# EasyEDA Pro project LuxcampBadge2025.epro, board PCB
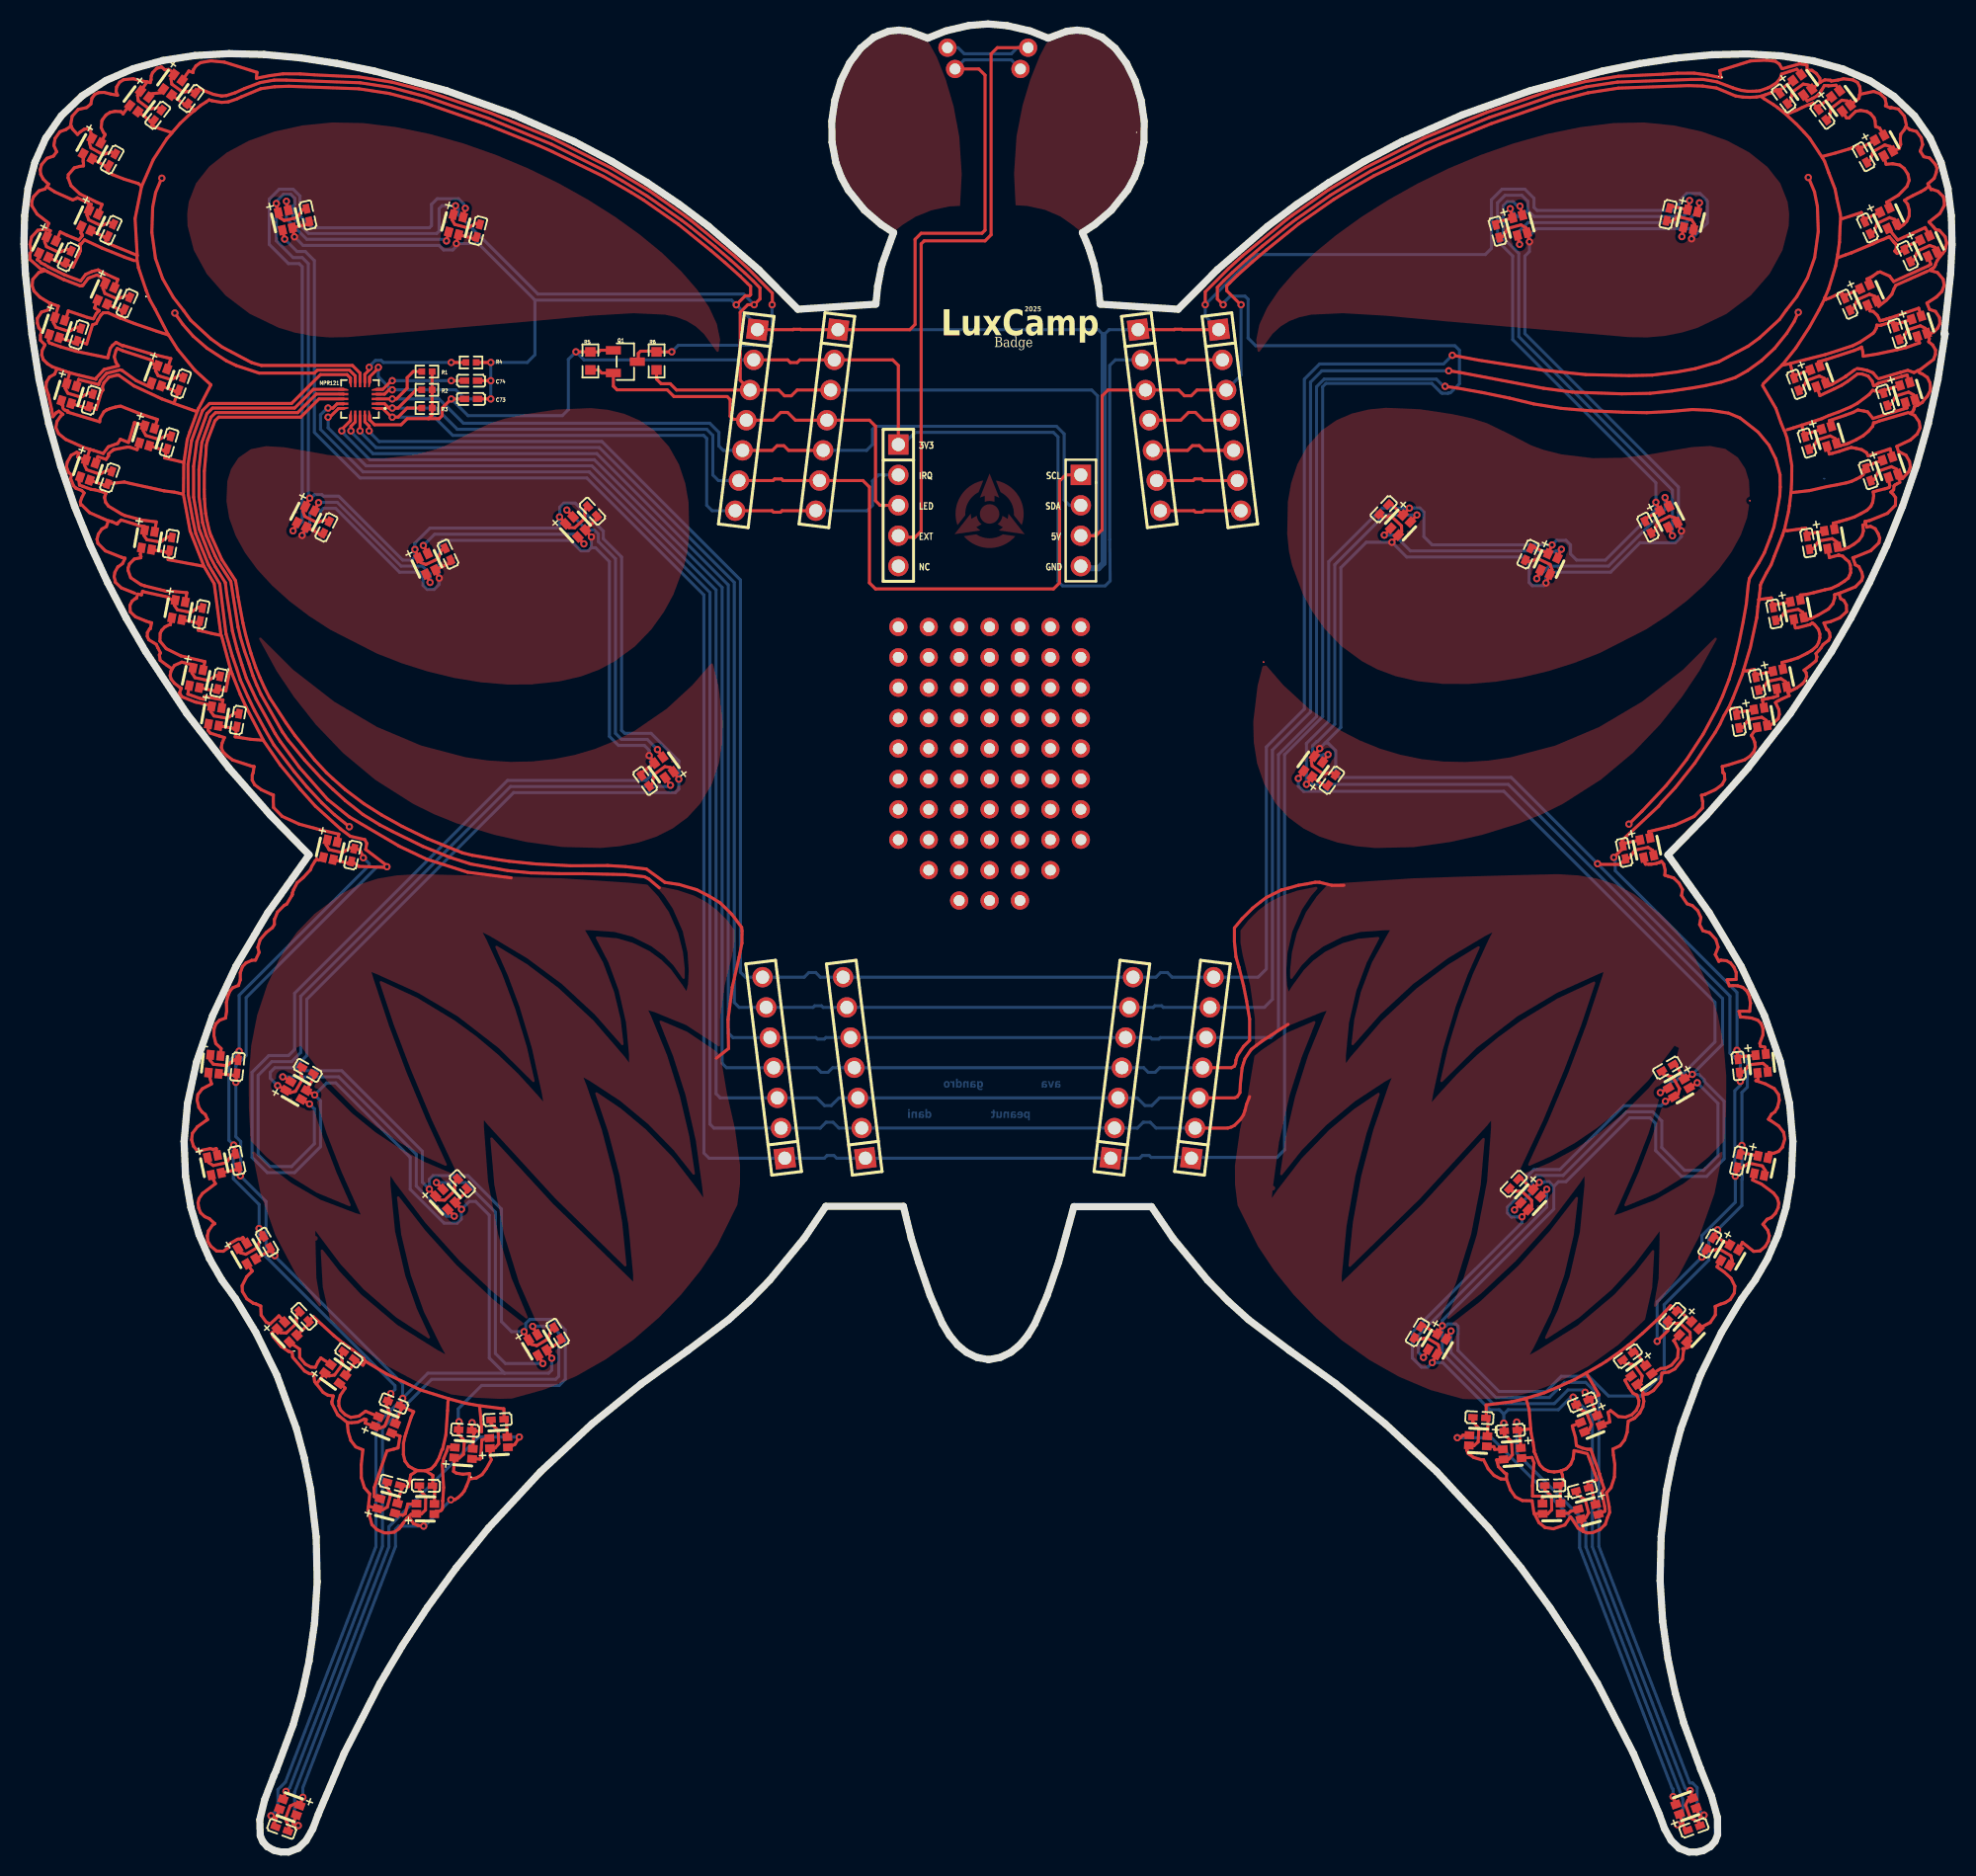
[diagram p9: board, top side]
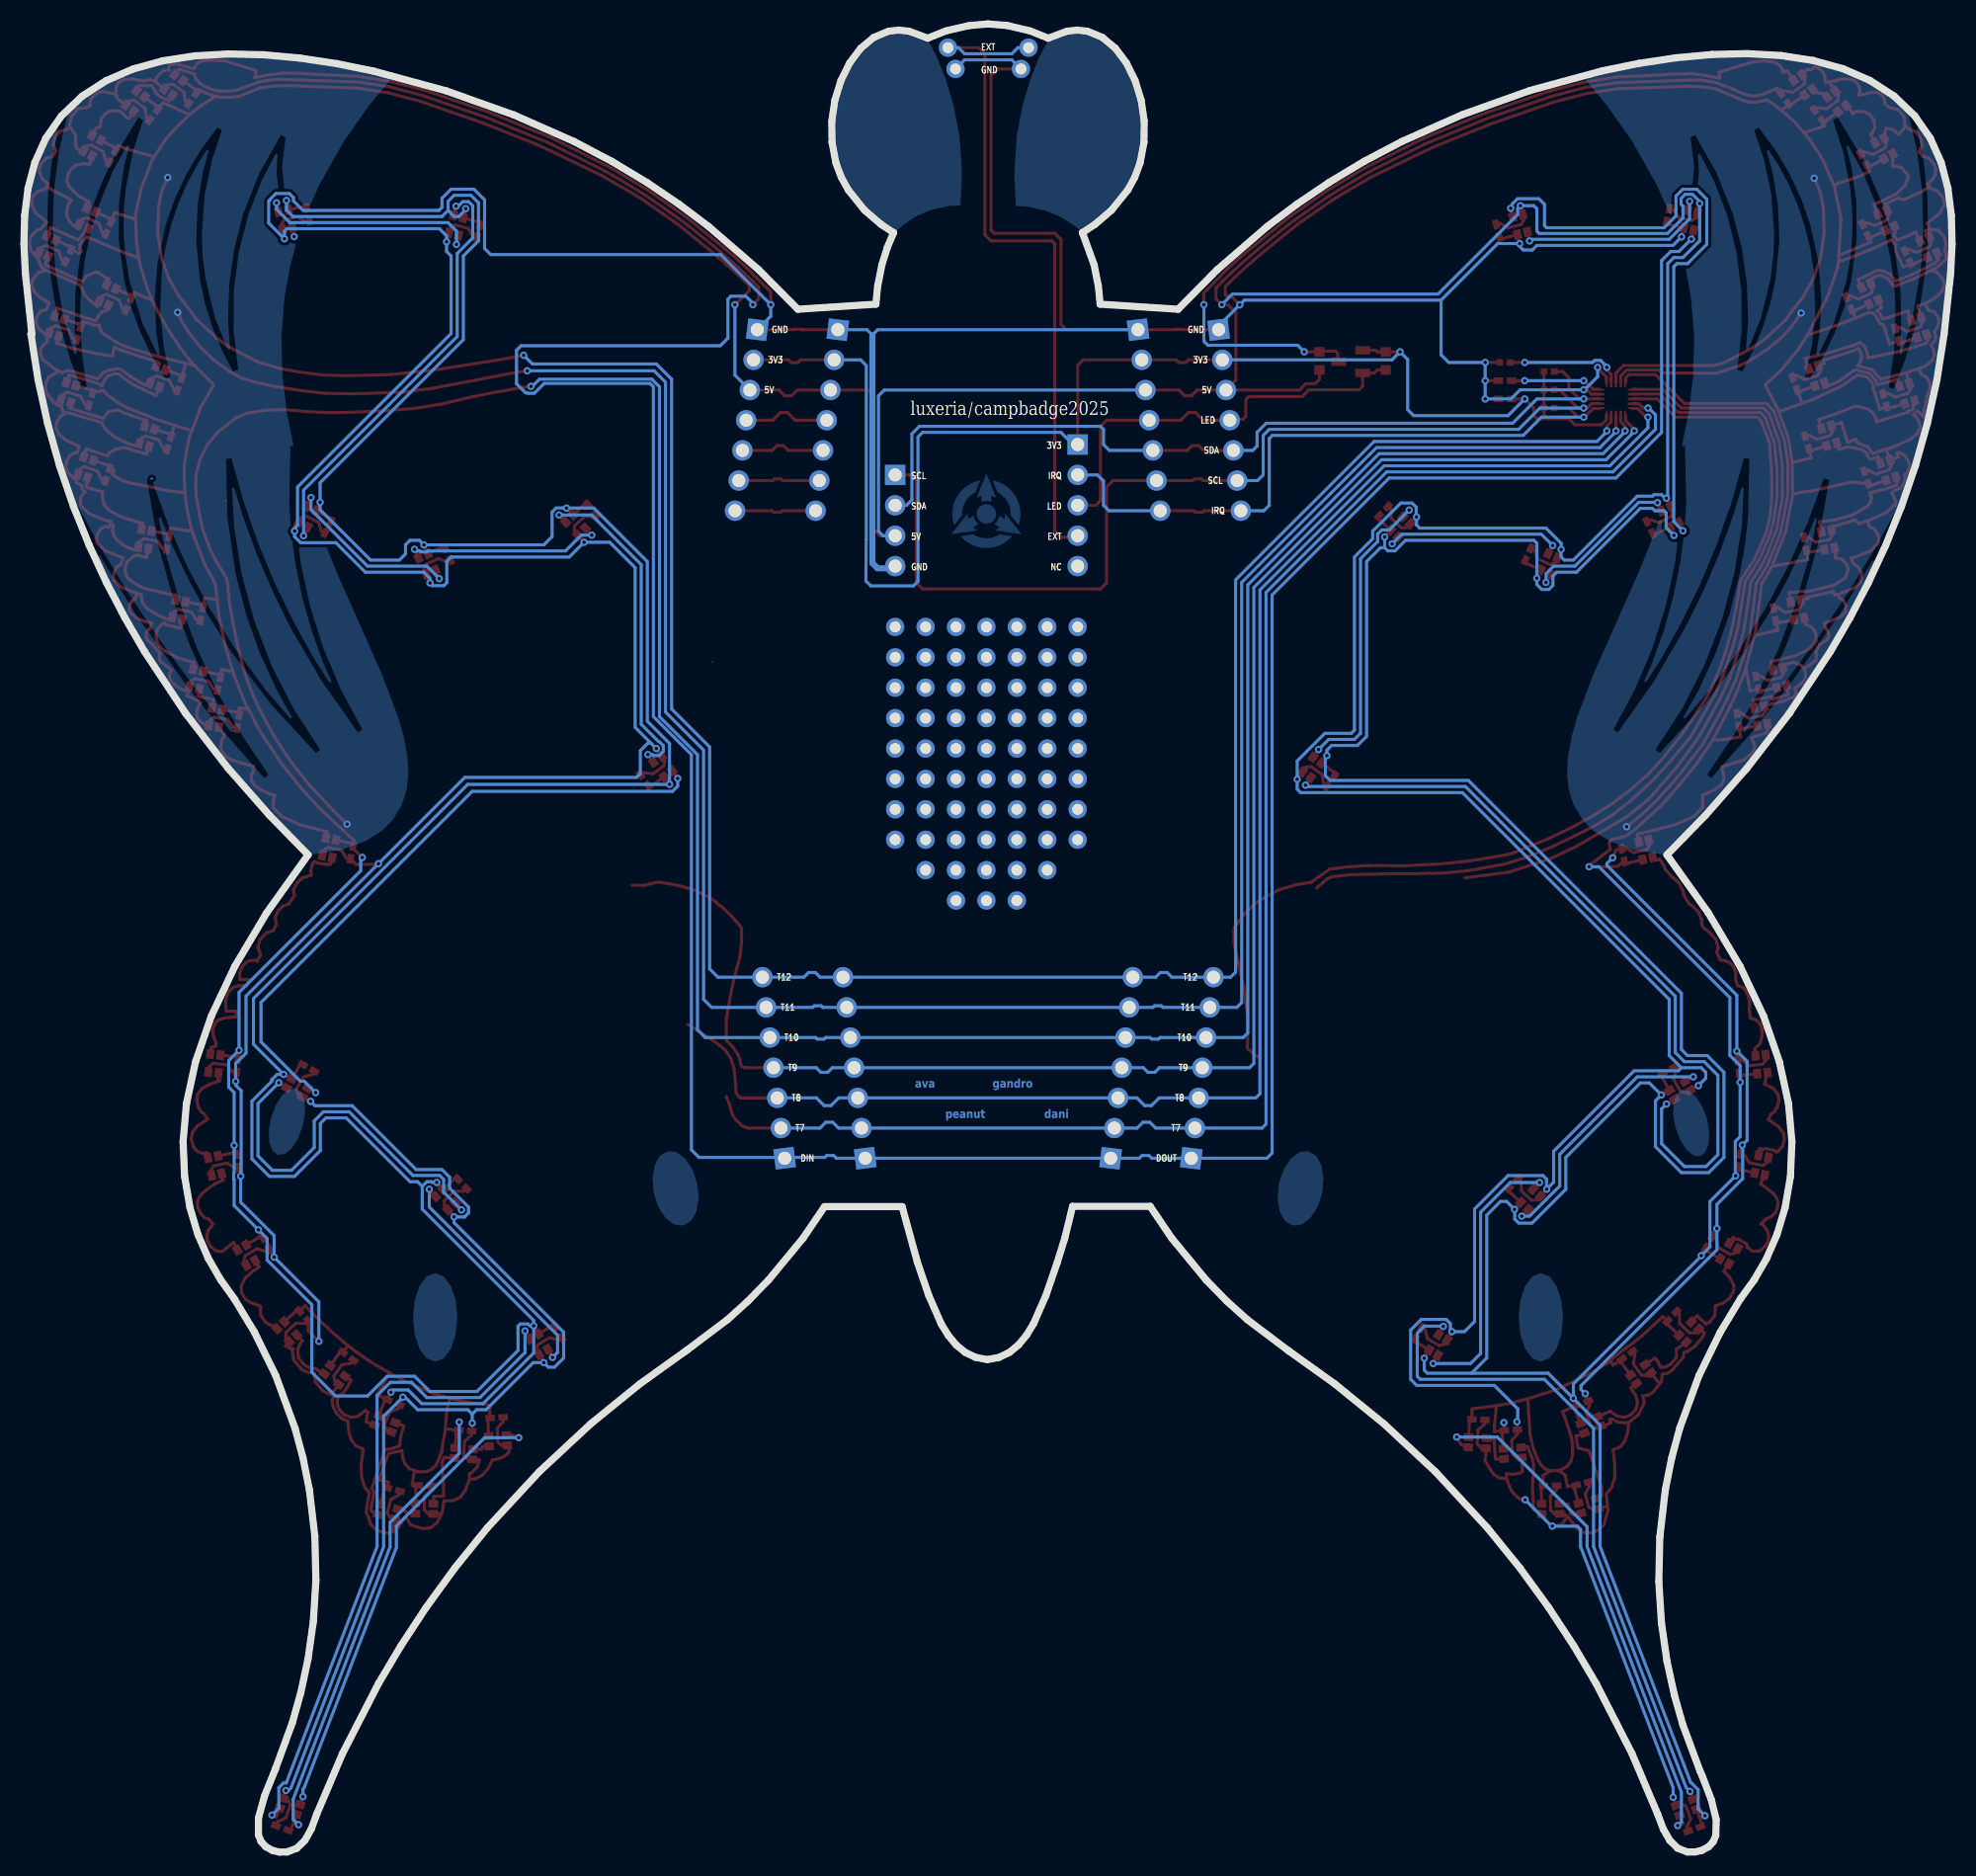
[diagram p10: board, bottom side, seen from below]

Outline 161.02 x 152.75 mm; copper layers: Top Layer, Bottom Layer. Coordinates in mm from the lower left corner of the outline.
Stack: Top Layer 0.035mm / Dielectric1 1.51mm FR4 er 4.5 / Bottom Layer 0.035mm

## Design rules (mm)
template: Custom Config
spacing copperThickness1oz (default): track to track 0.102, other pairs 0.152 to 0.3
spacing copperThickness2oz: track to track 0.203, other pairs 0.152 to 0.3
track width copperThickness1oz (default): min 0.127, default 0.254, max 2.54
track width copperThickness2oz: min 0.203, default 0.254, max 2.54
differential pair differentialPair (default): width min 0.127, default 0.254, max 2.54; gap min 0.152, default 0.152
via viaSize (default): diameter min 0.5, default 0.61, max 10; hole min 0.3, default 0.305, max 6.3
net $3N574 uses aestheticCopperRegion

## Placement (name value [footprint] x y rotation side)
C1  100nF  [C0402]  13.99 146.52 234 top
C2  100nF  [C0402]  11.17 145.11 233 top
C3  100nF  [C0402]  7.37 141.41 241 top
C4  100nF  [C0402]  7.25 135.52 245 top
C5  100nF  [C0402]  3.72 133.28 245 top
C6  100nF  [C0402]  8.62 129.4 246 top
C7  100nF  [C0402]  4.6 126.78 252 top
C8  100nF  [C0402]  13.12 122.68 250 top
C9  100nF  [C0402]  5.6 121.3 253 top
C10  100nF  [C0402]  12.12 117.77 253 top
C11  100nF  [C0402]  7.17 114.84 251 top
C12  100nF  [C0402]  12.27 109.3 260 top
C13  100nF  [C0402]  14.81 103.41 259 top
C14  100nF  [C0402]  16.27 97.7 258 top
C15  100nF  [C0402]  17.87 94.58 260 top
C16  100nF  [C0402]  27.46 83.3 257 top
C17  100nF  [C0402]  17.84 65.61 264 top
C18  100nF  [C0402]  17.8 57.79 282 top
C19  100nF  [C0402]  20.29 50.97 300 top
C20  100nF  [C0402]  23.4 44.76 313 top
C21  100nF  [C0402]  27.14 41.5 324 top
C22  100nF  [C0402]  30.89 37.48 338 top
C23  100nF  [C0402]  30.87 30.78 345 top
C24  100nF  [C0402]  33.57 30.61 359 top
C25  100nF  [C0402]  36.85 35.26 356 top
C26  100nF  [C0402]  39.55 36.14 3 top
C27  100nF  [C0402]  21.53 1.93 160 top
C28  100nF  [C0402]  44.57 43.36 301 top
C29  100nF  [C0402]  36.61 55.85 313 top
C30  100nF  [C0402]  23.7 65.31 330 top
C31  100nF  [C0402]  51.88 89.5 126 top
C32  100nF  [C0402]  47.48 112.03 313 top
C33  100nF  [C0402]  35.41 108.44 295 top
C34  100nF  [C0402]  25.26 110.68 243 top
C35  100nF  [C0402]  37.94 135.47 255 top
C36  100nF  [C0402]  23.72 136.78 283 top
C37  100nF  [C0402]  146.95 146.52 306 top
C38  100nF  [C0402]  150.2 145.15 307 top
C39  100nF  [C0402]  153.64 141.65 299 top
C40  100nF  [C0402]  153.96 135.71 295 top
C41  100nF  [C0402]  157.31 133.38 295 top
C42  100nF  [C0402]  152.28 129.33 294 top
C43  100nF  [C0402]  156.45 126.9 288 top
C44  100nF  [C0402]  148.03 122.63 290 top
C45  100nF  [C0402]  155.45 121.39 287 top
C46  100nF  [C0402]  148.91 117.73 287 top
C47  100nF  [C0402]  154.04 115.09 289 top
C48  100nF  [C0402]  149.01 109.39 280 top
C49  100nF  [C0402]  146.18 103.45 281 top
C50  100nF  [C0402]  144.74 97.62 282 top
C51  100nF  [C0402]  143.13 94.47 280 top
C52  100nF  [C0402]  133.64 83.52 282 top
C53  100nF  [C0402]  143.2 65.69 276 top
C54  100nF  [C0402]  143.19 57.75 258 top
C55  100nF  [C0402]  140.79 50.84 240 top
C56  100nF  [C0402]  137.66 44.8 227 top
C57  100nF  [C0402]  133.95 41.43 216 top
C58  100nF  [C0402]  130.15 37.58 202 top
C59  100nF  [C0402]  130.15 30.31 195 top
C60  100nF  [C0402]  127.55 30.63 181 top
C61  100nF  [C0402]  124.16 35.21 184 top
C62  100nF  [C0402]  121.55 36.3 177 top
C63  100nF  [C0402]  139.47 2.01 20 top
C64  100nF  [C0402]  116.38 43.43 239 top
C65  100nF  [C0402]  124.42 55.84 227 top
C66  100nF  [C0402]  137.25 65.53 210 top
C67  100nF  [C0402]  109.23 89.56 54 top
C68  100nF  [C0402]  113.56 112.2 227 top
C69  100nF  [C0402]  125.62 108.45 245 top
C70  100nF  [C0402]  135.63 110.7 297 top
C71  100nF  [C0402]  123.06 135.43 285 top
C72  100nF  [C0402]  137.3 136.83 257 top
C73  100nF  [C0402]  37.34 121.41 180 top
C74  100nF  [C0402]  37.34 122.94 180 top
H1  2.54-1*5  [HDR-TH_5P-P2.54-V-M]  73.02 112.52 270 top
H2  2.54-1*4  [HDR-TH_4P-P2.54-V-M-1]  88.26 111.25 270 top
H3  PZ2.54-1*7  [HDR-TH_7P-P2.54-V-M]  60.32 119.64 263 top
H4  PZ2.54-1*7  [HDR-TH_7P-P2.54-V-M]  67.06 119.64 263 top
H5  PZ2.54-1*7  [HDR-TH_7P-P2.54-V-M]  93.98 119.64 277 top
H6  PZ2.54-1*7  [HDR-TH_7P-P2.54-V-M]  100.71 119.64 277 top
H7  PZ2.54-1*7  [HDR-TH_7P-P2.54-V-M]  62.61 65.53 97 top
H8  PZ2.54-1*7  [HDR-TH_7P-P2.54-V-M]  69.34 65.53 97 top
H9  PZ2.54-1*7  [HDR-TH_7P-P2.54-V-M]  91.69 65.53 83 top
H10  PZ2.54-1*7  [HDR-TH_7P-P2.54-V-M]  98.42 65.53 83 top
LED1  XL-1615RGBC-WS2812B-S  [LED-SMD_4P-L1.6-W1.5_XL-1615RGBC-WS2812B-S]  12.43 147.66 54 top
LED2  XL-1615RGBC-WS2812B-S  [LED-SMD_4P-L1.6-W1.5_XL-1615RGBC-WS2812B-S]  9.63 146.28 53 top
LED3  XL-1615RGBC-WS2812B-S  [LED-SMD_4P-L1.6-W1.5_XL-1615RGBC-WS2812B-S]  5.68 142.35 61 top
LED4  XL-1615RGBC-WS2812B-S  [LED-SMD_4P-L1.6-W1.5_XL-1615RGBC-WS2812B-S]  5.5 136.34 65 top
LED5  XL-1615RGBC-WS2812B-S  [LED-SMD_4P-L1.6-W1.5_XL-1615RGBC-WS2812B-S]  1.97 134.11 65 top
LED6  XL-1615RGBC-WS2812B-S  [LED-SMD_4P-L1.6-W1.5_XL-1615RGBC-WS2812B-S]  6.85 130.2 66 top
LED7  XL-1615RGBC-WS2812B-S  [LED-SMD_4P-L1.6-W1.5_XL-1615RGBC-WS2812B-S]  2.76 127.38 72 top
LED8  XL-1615RGBC-WS2812B-S  [LED-SMD_4P-L1.6-W1.5_XL-1615RGBC-WS2812B-S]  11.31 123.35 70 top
LED9  XL-1615RGBC-WS2812B-S  [LED-SMD_4P-L1.6-W1.5_XL-1615RGBC-WS2812B-S]  3.76 121.87 73 top
LED10  XL-1615RGBC-WS2812B-S  [LED-SMD_4P-L1.6-W1.5_XL-1615RGBC-WS2812B-S]  10.27 118.34 73 top
LED11  XL-1615RGBC-WS2812B-S  [LED-SMD_4P-L1.6-W1.5_XL-1615RGBC-WS2812B-S]  5.34 115.47 71 top
LED12  XL-1615RGBC-WS2812B-S  [LED-SMD_4P-L1.6-W1.5_XL-1615RGBC-WS2812B-S]  10.36 109.64 80 top
LED13  XL-1615RGBC-WS2812B-S  [LED-SMD_4P-L1.6-W1.5_XL-1615RGBC-WS2812B-S]  12.91 103.78 79 top
LED14  XL-1615RGBC-WS2812B-S  [LED-SMD_4P-L1.6-W1.5_XL-1615RGBC-WS2812B-S]  14.38 98.11 78 top
LED15  XL-1615RGBC-WS2812B-S  [LED-SMD_4P-L1.6-W1.5_XL-1615RGBC-WS2812B-S]  15.96 94.92 80 top
LED16  XL-1615RGBC-WS2812B-S  [LED-SMD_4P-L1.6-W1.5_XL-1615RGBC-WS2812B-S]  25.58 83.75 77 top
LED17  XL-1615RGBC-WS2812B-S  [LED-SMD_4P-L1.6-W1.5_XL-1615RGBC-WS2812B-S]  15.91 65.82 84 top
LED18  XL-1615RGBC-WS2812B-S  [LED-SMD_4P-L1.6-W1.5_XL-1615RGBC-WS2812B-S]  15.9 57.39 102 top
LED19  XL-1615RGBC-WS2812B-S  [LED-SMD_4P-L1.6-W1.5_XL-1615RGBC-WS2812B-S]  18.61 50 120 top
LED20  XL-1615RGBC-WS2812B-S  [LED-SMD_4P-L1.6-W1.5_XL-1615RGBC-WS2812B-S]  21.98 43.45 133 top
LED21  XL-1615RGBC-WS2812B-S  [LED-SMD_4P-L1.6-W1.5_XL-1615RGBC-WS2812B-S]  25.99 39.94 144 top
LED22  XL-1615RGBC-WS2812B-S  [LED-SMD_4P-L1.6-W1.5_XL-1615RGBC-WS2812B-S]  30.16 35.69 158 top
LED23  XL-1615RGBC-WS2812B-S  [LED-SMD_4P-L1.6-W1.5_XL-1615RGBC-WS2812B-S]  30.36 28.92 165 top
LED24  XL-1615RGBC-WS2812B-S  [LED-SMD_4P-L1.6-W1.5_XL-1615RGBC-WS2812B-S]  33.53 28.68 179 top
LED25  XL-1615RGBC-WS2812B-S  [LED-SMD_4P-L1.6-W1.5_XL-1615RGBC-WS2812B-S]  36.7 33.33 176 top
LED26  XL-1615RGBC-WS2812B-S  [LED-SMD_4P-L1.6-W1.5_XL-1615RGBC-WS2812B-S]  39.65 34.21 183 top
LED27  XL-1615RGBC-WS2812B-S  [LED-SMD_4P-L1.6-W1.5_XL-1615RGBC-WS2812B-S]  22.19 3.75 340 top
LED28  XL-1615RGBC-WS2812B-S  [LED-SMD_4P-L1.6-W1.5_XL-1615RGBC-WS2812B-S]  42.91 42.37 121 top
LED29  XL-1615RGBC-WS2812B-S  [LED-SMD_4P-L1.6-W1.5_XL-1615RGBC-WS2812B-S]  35.19 54.54 133 top
LED30  XL-1615RGBC-WS2812B-S  [LED-SMD_4P-L1.6-W1.5_XL-1615RGBC-WS2812B-S]  22.73 63.64 150 top
LED31  XL-1615RGBC-WS2812B-S  [LED-SMD_4P-L1.6-W1.5_XL-1615RGBC-WS2812B-S]  53.45 90.63 306 top
LED32  XL-1615RGBC-WS2812B-S  [LED-SMD_4P-L1.6-W1.5_XL-1615RGBC-WS2812B-S]  46.06 110.72 133 top
LED33  XL-1615RGBC-WS2812B-S  [LED-SMD_4P-L1.6-W1.5_XL-1615RGBC-WS2812B-S]  33.66 107.63 115 top
LED34  XL-1615RGBC-WS2812B-S  [LED-SMD_4P-L1.6-W1.5_XL-1615RGBC-WS2812B-S]  23.53 111.57 63 top
LED35  XL-1615RGBC-WS2812B-S  [LED-SMD_4P-L1.6-W1.5_XL-1615RGBC-WS2812B-S]  36.07 135.98 75 top
LED36  XL-1615RGBC-WS2812B-S  [LED-SMD_4P-L1.6-W1.5_XL-1615RGBC-WS2812B-S]  21.83 136.35 103 top
LED37  XL-1615RGBC-WS2812B-S  [LED-SMD_4P-L1.6-W1.5_XL-1615RGBC-WS2812B-S]  148.52 147.66 126 top
LED38  XL-1615RGBC-WS2812B-S  [LED-SMD_4P-L1.6-W1.5_XL-1615RGBC-WS2812B-S]  151.75 146.31 127 top
LED39  XL-1615RGBC-WS2812B-S  [LED-SMD_4P-L1.6-W1.5_XL-1615RGBC-WS2812B-S]  155.33 142.58 119 top
LED40  XL-1615RGBC-WS2812B-S  [LED-SMD_4P-L1.6-W1.5_XL-1615RGBC-WS2812B-S]  155.72 136.52 115 top
LED41  XL-1615RGBC-WS2812B-S  [LED-SMD_4P-L1.6-W1.5_XL-1615RGBC-WS2812B-S]  159.07 134.19 115 top
LED42  XL-1615RGBC-WS2812B-S  [LED-SMD_4P-L1.6-W1.5_XL-1615RGBC-WS2812B-S]  154.05 130.11 114 top
LED43  XL-1615RGBC-WS2812B-S  [LED-SMD_4P-L1.6-W1.5_XL-1615RGBC-WS2812B-S]  158.29 127.49 108 top
LED44  XL-1615RGBC-WS2812B-S  [LED-SMD_4P-L1.6-W1.5_XL-1615RGBC-WS2812B-S]  149.85 123.29 110 top
LED45  XL-1615RGBC-WS2812B-S  [LED-SMD_4P-L1.6-W1.5_XL-1615RGBC-WS2812B-S]  157.31 121.95 107 top
LED46  XL-1615RGBC-WS2812B-S  [LED-SMD_4P-L1.6-W1.5_XL-1615RGBC-WS2812B-S]  150.76 118.29 107 top
LED47  XL-1615RGBC-WS2812B-S  [LED-SMD_4P-L1.6-W1.5_XL-1615RGBC-WS2812B-S]  155.87 115.72 109 top
LED48  XL-1615RGBC-WS2812B-S  [LED-SMD_4P-L1.6-W1.5_XL-1615RGBC-WS2812B-S]  150.92 109.72 100 top
LED49  XL-1615RGBC-WS2812B-S  [LED-SMD_4P-L1.6-W1.5_XL-1615RGBC-WS2812B-S]  148.08 103.81 101 top
LED50  XL-1615RGBC-WS2812B-S  [LED-SMD_4P-L1.6-W1.5_XL-1615RGBC-WS2812B-S]  146.64 98.02 102 top
LED51  XL-1615RGBC-WS2812B-S  [LED-SMD_4P-L1.6-W1.5_XL-1615RGBC-WS2812B-S]  145.04 94.79 100 top
LED52  XL-1615RGBC-WS2812B-S  [LED-SMD_4P-L1.6-W1.5_XL-1615RGBC-WS2812B-S]  135.54 83.92 102 top
LED53  XL-1615RGBC-WS2812B-S  [LED-SMD_4P-L1.6-W1.5_XL-1615RGBC-WS2812B-S]  145.12 65.89 96 top
LED54  XL-1615RGBC-WS2812B-S  [LED-SMD_4P-L1.6-W1.5_XL-1615RGBC-WS2812B-S]  145.08 57.34 78 top
LED55  XL-1615RGBC-WS2812B-S  [LED-SMD_4P-L1.6-W1.5_XL-1615RGBC-WS2812B-S]  142.46 49.87 60 top
LED56  XL-1615RGBC-WS2812B-S  [LED-SMD_4P-L1.6-W1.5_XL-1615RGBC-WS2812B-S]  139.07 43.47 47 top
LED57  XL-1615RGBC-WS2812B-S  [LED-SMD_4P-L1.6-W1.5_XL-1615RGBC-WS2812B-S]  135.08 39.86 36 top
LED58  XL-1615RGBC-WS2812B-S  [LED-SMD_4P-L1.6-W1.5_XL-1615RGBC-WS2812B-S]  130.87 35.79 22 top
LED59  XL-1615RGBC-WS2812B-S  [LED-SMD_4P-L1.6-W1.5_XL-1615RGBC-WS2812B-S]  130.65 28.44 15 top
LED60  XL-1615RGBC-WS2812B-S  [LED-SMD_4P-L1.6-W1.5_XL-1615RGBC-WS2812B-S]  127.58 28.7 1 top
LED61  XL-1615RGBC-WS2812B-S  [LED-SMD_4P-L1.6-W1.5_XL-1615RGBC-WS2812B-S]  124.29 33.28 4 top
LED62  XL-1615RGBC-WS2812B-S  [LED-SMD_4P-L1.6-W1.5_XL-1615RGBC-WS2812B-S]  121.44 34.36 357 top
LED63  XL-1615RGBC-WS2812B-S  [LED-SMD_4P-L1.6-W1.5_XL-1615RGBC-WS2812B-S]  138.81 3.83 200 top
LED64  XL-1615RGBC-WS2812B-S  [LED-SMD_4P-L1.6-W1.5_XL-1615RGBC-WS2812B-S]  118.03 42.43 59 top
LED65  XL-1615RGBC-WS2812B-S  [LED-SMD_4P-L1.6-W1.5_XL-1615RGBC-WS2812B-S]  125.83 54.51 47 top
LED66  XL-1615RGBC-WS2812B-S  [LED-SMD_4P-L1.6-W1.5_XL-1615RGBC-WS2812B-S]  138.21 63.85 30 top
LED67  XL-1615RGBC-WS2812B-S  [LED-SMD_4P-L1.6-W1.5_XL-1615RGBC-WS2812B-S]  107.66 90.7 234 top
LED68  XL-1615RGBC-WS2812B-S  [LED-SMD_4P-L1.6-W1.5_XL-1615RGBC-WS2812B-S]  114.97 110.87 47 top
LED69  XL-1615RGBC-WS2812B-S  [LED-SMD_4P-L1.6-W1.5_XL-1615RGBC-WS2812B-S]  127.37 107.62 65 top
LED70  XL-1615RGBC-WS2812B-S  [LED-SMD_4P-L1.6-W1.5_XL-1615RGBC-WS2812B-S]  137.36 111.57 117 top
LED71  XL-1615RGBC-WS2812B-S  [LED-SMD_4P-L1.6-W1.5_XL-1615RGBC-WS2812B-S]  124.93 135.93 105 top
LED72  XL-1615RGBC-WS2812B-S  [LED-SMD_4P-L1.6-W1.5_XL-1615RGBC-WS2812B-S]  139.19 136.39 77 top
MPR121  MPR121QR2  [QFN-20_L3.0-W3.0-P0.40-BL]  28.07 121.41 90 top
NOREF  -  [Pad_e298]  78.1 102.36 0 top
NOREF#2  -  [Pad_e372]  83.18 99.82 0 top
NOREF#3  -  [Pad_e369]  73.02 84.58 0 top
NOREF#4  -  [Pad_e333]  78.1 99.82 0 top
NOREF#5  -  [Pad_e409]  73.02 87.12 0 top
NOREF#6  -  [Pad_e514]  80.64 97.28 0 top
NOREF#7  -  [Pad_e337]  78.1 87.12 0 top
NOREF#8  -  [Pad_e552]  78.1 89.66 0 top
NOREF#9  -  [Pad_e7361]  83.22 148.98 0 top
NOREF#10  -  [Pad_e306]  88.26 94.74 0 top
NOREF#11  -  [Pad_e563]  78.1 79.5 0 top
NOREF#12  -  [Pad_e551]  80.64 82.04 0 top
NOREF#13  -  [Pad_e511]  78.1 97.28 0 top
NOREF#14  -  [Pad_e307]  83.18 89.66 0 top
NOREF#15  -  [Pad_e323]  85.72 102.36 0 top
NOREF#16  -  [Pad_e554]  85.72 82.04 0 top
NOREF#17  -  [Pad_e553]  83.18 82.04 0 top
NOREF#18  -  [Pad_e166]  83.18 102.36 0 top
NOREF#19  -  [Pad_e525]  88.26 84.58 0 top
NOREF#20  -  [Pad_e376]  88.26 97.28 0 top
NOREF#21  -  [Pad_e508]  75.56 87.12 0 top
NOREF#22  -  [Pad_e533]  75.56 82.04 0 top
NOREF#23  -  [Pad_e517]  78.1 84.58 0 top
NOREF#24  -  [Pad_e515]  83.18 97.28 0 top
NOREF#25  -  [Pad_e80]  75.56 102.36 0 top
NOREF#26  -  [Pad_e332]  75.56 99.82 0 top
NOREF#27  -  [Pad_e374]  88.26 99.82 0 top
NOREF#28  -  [Pad_e567]  83.18 79.5 0 top
NOREF#29  -  [Pad_e322]  80.64 89.66 0 top
NOREF#30  -  [Pad_e301]  83.18 94.74 0 top
NOREF#31  -  [Pad_e509]  75.56 97.28 0 top
NOREF#32  -  [Pad_e325]  73.02 99.82 0 top
NOREF#33  -  [Pad_e335]  88.26 89.66 0 top
NOREF#34  -  [Pad_e338]  80.64 87.12 0 top
NOREF#35  -  [Pad_e521]  73.02 89.66 0 top
NOREF#36  -  [Pad_e329]  73.02 92.2 0 top
NOREF#37  -  [Pad_e516]  75.56 84.58 0 top
NOREF#38  -  [Pad_e524]  85.72 84.58 0 top
NOREF#39  -  [Pad_e33]  73.02 102.36 0 top
NOREF#40  -  [Pad_e550]  78.1 82.04 0 top
NOREF#41  -  [Pad_e86]  80.64 102.36 0 top
NOREF#42  -  [Pad_e334]  85.72 89.66 0 top
NOREF#43  -  [Pad_e328]  85.72 97.28 0 top
NOREF#44  -  [Pad_e522]  80.64 84.58 0 top
NOREF#45  -  [Pad_e324]  88.26 102.36 0 top
NOREF#46  -  [Pad_e512]  80.64 94.74 0 top
NOREF#47  -  [Pad_e331]  88.26 87.12 0 top
NOREF#48  -  [Pad_e412]  83.18 92.2 0 top
NOREF#49  -  [Pad_e348]  80.64 99.82 0 top
NOREF#50  -  [Pad_e7359]  77.13 150.76 0 top
NOREF#51  -  [Pad_e513]  83.18 87.12 0 top
NOREF#52  -  [Pad_e7358]  83.86 150.76 0 top
NOREF#53  -  [Pad_e371]  80.64 92.2 0 top
NOREF#54  -  [Pad_e419]  85.72 92.2 0 top
NOREF#55  -  [Pad_e373]  85.72 99.82 0 top
NOREF#56  -  [Pad_e7363]  77.76 148.98 0 top
NOREF#57  -  [Pad_e505]  88.26 92.2 0 top
NOREF#58  -  [Pad_e387]  73.02 94.74 0 top
NOREF#59  -  [Pad_e565]  80.64 79.5 0 top
NOREF#60  -  [Pad_e305]  85.72 94.74 0 top
NOREF#61  -  [Pad_e523]  83.18 84.58 0 top
NOREF#62  -  [Pad_e507]  75.56 94.74 0 top
NOREF#63  -  [Pad_e330]  75.56 92.2 0 top
NOREF#64  -  [Pad_e510]  78.1 94.74 0 top
NOREF#65  -  [Pad_e526]  75.56 89.66 0 top
NOREF#66  -  [Pad_e518]  85.72 87.12 0 top
NOREF#67  -  [Pad_e370]  78.1 92.2 0 top
NOREF#68  -  [Pad_e389]  73.02 97.28 0 top
Q1  BSS138  [SOT-23-3_L2.9-W1.3-P1.90-LS2.4-BR]  50.22 124.53 180 top
R1  4.7kΩ  [R0402]  33.65 123.7 0 top
R2  4.7kΩ  [R0402]  33.65 122.18 0 top
R3  4.7kΩ  [R0402]  33.65 120.65 0 top
R4  75kΩ  [R0402]  37.34 124.46 0 top
R5  1kΩ  [R0603]  47.3 124.59 90 top
R6  1kΩ  [R0603]  52.83 124.59 270 top

## Footprints (pads in the part's own frame, mm; a bottom-side part is the same pattern mirrored in y, then rotated)
C0402
  rect 0.79x0.54 smd: 1(-0.545,0) 2(0.545,0)
HDR-TH_4P-P2.54-V-M-1
  rect 1.7x1.7 hole 1.1: 1(-3.81,0)
  round 1.7 hole 1.1: 2(-1.27,0) 3(1.27,0) 4(3.81,0)
HDR-TH_5P-P2.54-V-M
  rect 1.7x1.7 hole 1.1: 1(-5.08,0)
  round 1.7 hole 1.1: 2(-2.54,0) 3(0,0) 4(2.54,0) 5(5.08,0)
HDR-TH_7P-P2.54-V-M
  rect 1.7x1.7 hole 1.1: 1(-7.62,0)
  round 1.7 hole 1.1: 2(-5.08,0) 3(-2.54,0) 4(0,0) 5(2.54,0) 6(5.08,0) 7(7.62,0)
LED-SMD_4P-L1.6-W1.5_XL-1615RGBC-WS2812B-S
  rect 0.8x0.65 smd: 1(-0.75,0.425) 2(0.75,0.425) 3(-0.75,-0.425) 4(0.75,-0.425)
Pad_e33
  round 1.524 hole 0.914: (0,0)
Pad_e80
  round 1.524 hole 0.914: (0,0)
Pad_e86
  round 1.524 hole 0.914: (0,0)
Pad_e166
  round 1.524 hole 0.914: (0,0)
Pad_e298
  round 1.524 hole 0.914: (0,0)
Pad_e301
  round 1.524 hole 0.914: (0,0)
Pad_e305
  round 1.524 hole 0.914: (0,0)
Pad_e306
  round 1.524 hole 0.914: (0,0)
Pad_e307
  round 1.524 hole 0.914: (0,0)
Pad_e322
  round 1.524 hole 0.914: (0,0)
Pad_e323
  round 1.524 hole 0.914: (0,0)
Pad_e324
  round 1.524 hole 0.914: (0,0)
Pad_e325
  round 1.524 hole 0.914: (0,0)
Pad_e328
  round 1.524 hole 0.914: (0,0)
Pad_e329
  round 1.524 hole 0.914: (0,0)
Pad_e330
  round 1.524 hole 0.914: (0,0)
Pad_e331
  round 1.524 hole 0.914: (0,0)
Pad_e332
  round 1.524 hole 0.914: (0,0)
Pad_e333
  round 1.524 hole 0.914: (0,0)
Pad_e334
  round 1.524 hole 0.914: (0,0)
Pad_e335
  round 1.524 hole 0.914: (0,0)
Pad_e337
  round 1.524 hole 0.914: (0,0)
Pad_e338
  round 1.524 hole 0.914: (0,0)
Pad_e348
  round 1.524 hole 0.914: (0,0)
Pad_e369
  round 1.524 hole 0.914: (0,0)
Pad_e370
  round 1.524 hole 0.914: (0,0)
Pad_e371
  round 1.524 hole 0.914: (0,0)
Pad_e372
  round 1.524 hole 0.914: (0,0)
Pad_e373
  round 1.524 hole 0.914: (0,0)
Pad_e374
  round 1.524 hole 0.914: (0,0)
Pad_e376
  round 1.524 hole 0.914: (0,0)
Pad_e387
  round 1.524 hole 0.914: (0,0)
Pad_e389
  round 1.524 hole 0.914: (0,0)
Pad_e409
  round 1.524 hole 0.914: (0,0)
Pad_e412
  round 1.524 hole 0.914: (0,0)
Pad_e419
  round 1.524 hole 0.914: (0,0)
Pad_e505
  round 1.524 hole 0.914: (0,0)
Pad_e507
  round 1.524 hole 0.914: (0,0)
Pad_e508
  round 1.524 hole 0.914: (0,0)
Pad_e509
  round 1.524 hole 0.914: (0,0)
Pad_e510
  round 1.524 hole 0.914: (0,0)
Pad_e511
  round 1.524 hole 0.914: (0,0)
Pad_e512
  round 1.524 hole 0.914: (0,0)
Pad_e513
  round 1.524 hole 0.914: (0,0)
Pad_e514
  round 1.524 hole 0.914: (0,0)
Pad_e515
  round 1.524 hole 0.914: (0,0)
Pad_e516
  round 1.524 hole 0.914: (0,0)
Pad_e517
  round 1.524 hole 0.914: (0,0)
Pad_e518
  round 1.524 hole 0.914: (0,0)
Pad_e521
  round 1.524 hole 0.914: (0,0)
Pad_e522
  round 1.524 hole 0.914: (0,0)
Pad_e523
  round 1.524 hole 0.914: (0,0)
Pad_e524
  round 1.524 hole 0.914: (0,0)
Pad_e525
  round 1.524 hole 0.914: (0,0)
Pad_e526
  round 1.524 hole 0.914: (0,0)
Pad_e533
  round 1.524 hole 0.914: (0,0)
Pad_e550
  round 1.524 hole 0.914: (0,0)
Pad_e551
  round 1.524 hole 0.914: (0,0)
Pad_e552
  round 1.524 hole 0.914: (0,0)
Pad_e553
  round 1.524 hole 0.914: (0,0)
Pad_e554
  round 1.524 hole 0.914: (0,0)
Pad_e563
  round 1.524 hole 0.914: (0,0)
Pad_e565
  round 1.524 hole 0.914: (0,0)
Pad_e567
  round 1.524 hole 0.914: (0,0)
Pad_e7358
  round 1.524 hole 0.914: 4(0,0)
Pad_e7359
  round 1.524 hole 0.914: 1(0,0)
Pad_e7361
  round 1.524 hole 0.914: 3(0,0)
Pad_e7363
  round 1.524 hole 0.914: 2(0,0)
QFN-20_L3.0-W3.0-P0.40-BL
  custom 0.224x0.825 smd: 1(-0.8,-1.387) 5(0.8,-1.387) 11(0.8,1.387) 15(-0.8,1.387)
  rect 0.2x0.825 smd: 2(-0.4,-1.387) 3(0,-1.387) 4(0.4,-1.387) 12(0.4,1.387) 13(0,1.387) 14(-0.4,1.387)
  custom 0.825x0.224 smd: 6(1.387,-0.8) 10(1.387,0.8) 16(-1.387,0.8) 20(-1.387,-0.8)
  rect 0.825x0.2 smd: 7(1.387,-0.4) 8(1.387,0) 9(1.387,0.4) 17(-1.387,0.4) 18(-1.387,0) 19(-1.387,-0.4)
R0402
  rect 0.566x0.54 smd: 1(-0.433,0) 2(0.433,0)
R0603
  rect 0.806x0.864 smd: 1(-0.753,0) 2(0.753,0)
SOT-23-3_L2.9-W1.3-P1.90-LS2.4-BR
  rect 1.25x0.7 smd: 1(1,-0.95) 2(1,0.95) 3(-1,0)

## Nets
3V3: C73.2 H1.1 H3.2 H4.2 H5.2 H6.2 MPR121.20 Q1.1 R1.2 R2.2 R3.2 R5.2
+5V: C1.1 C2.1 C3.1 C4.1 C5.1 C6.1 C7.1 C8.1 C9.1 C10.1 C11.1 C12.1 C13.1 C14.1 C15.1 C16.1 C17.1 C18.1 C19.1 C20.1 C21.1 C22.1 C23.1 C24.1 C25.1 C26.1 C27.1 C28.1 C29.1 C30.1 C31.1 C32.1 C33.1 C34.1 C35.1 C36.1 C37.1 C38.1 C39.1 C40.1 C41.1 C42.1 C43.1 C44.1 C45.1 C46.1 C47.1 C48.1 C49.1 C50.1 C51.1 C52.1 C53.1 C54.1 C55.1 C56.1 C57.1 C58.1 C59.1 C60.1 C61.1 C62.1 C63.1 C64.1 C65.1 C66.1 C67.1 C68.1 C69.1 C70.1 C71.1 C72.1 H2.3 H3.3 H4.3 H5.3 H6.3 LED1.2 LED2.2 LED3.2 LED4.2 LED5.2 LED6.2 LED7.2 LED8.2 LED9.2 LED10.2 LED11.2 LED12.2 LED13.2 LED14.2 LED15.2 LED16.2 LED17.2 LED18.2 LED19.2 LED20.2 LED21.2 LED22.2 LED23.2 LED24.2 LED25.2 LED26.2 LED27.2 LED28.2 LED29.2 LED30.2 LED31.2 LED32.2 LED33.2 LED34.2 LED35.2 LED36.2 LED37.2 LED38.2 LED39.2 LED40.2 LED41.2 LED42.2 LED43.2 LED44.2 LED45.2 LED46.2 LED47.2 LED48.2 LED49.2 LED50.2 LED51.2 LED52.2 LED53.2 LED54.2 LED55.2 LED56.2 LED57.2 LED58.2 LED59.2 LED60.2 LED61.2 LED62.2 LED63.2 LED64.2 LED65.2 LED66.2 LED67.2 LED68.2 LED69.2 LED70.2 LED71.2 LED72.2 R6.2
GND: C1.2 C2.2 C3.2 C4.2 C5.2 C6.2 C7.2 C8.2 C9.2 C10.2 C11.2 C12.2 C13.2 C14.2 C15.2 C16.2 C17.2 C18.2 C19.2 C20.2 C21.2 C22.2 C23.2 C24.2 C25.2 C26.2 C27.2 C28.2 C29.2 C30.2 C31.2 C32.2 C33.2 C34.2 C35.2 C36.2 C37.2 C38.2 C39.2 C40.2 C41.2 C42.2 C43.2 C44.2 C45.2 C46.2 C47.2 C48.2 C49.2 C50.2 C51.2 C52.2 C53.2 C54.2 C55.2 C56.2 C57.2 C58.2 C59.2 C60.2 C61.2 C62.2 C63.2 C64.2 C65.2 C66.2 C67.2 C68.2 C69.2 C70.2 C71.2 C72.2 C73.1 C74.1 H2.4 H3.1 H4.1 H5.1 H6.1 LED1.3 LED2.3 LED3.3 LED4.3 LED5.3 LED6.3 LED7.3 LED8.3 LED9.3 LED10.3 LED11.3 LED12.3 LED13.3 LED14.3 LED15.3 LED16.3 LED17.3 LED18.3 LED19.3 LED20.3 LED21.3 LED22.3 LED23.3 LED24.3 LED25.3 LED26.3 LED27.3 LED28.3 LED29.3 LED30.3 LED31.3 LED32.3 LED33.3 LED34.3 LED35.3 LED36.3 LED37.3 LED38.3 LED39.3 LED40.3 LED41.3 LED42.3 LED43.3 LED44.3 LED45.3 LED46.3 LED47.3 LED48.3 LED49.3 LED50.3 LED51.3 LED52.3 LED53.3 LED54.3 LED55.3 LED56.3 LED57.3 LED58.3 LED59.3 LED60.3 LED61.3 LED62.3 LED63.3 LED64.3 LED65.3 LED66.3 LED67.3 LED68.3 LED69.3 LED70.3 LED71.3 LED72.3 MPR121.4 MPR121.6 NOREF#9.3 NOREF#56.2 R4.2
ATOMG19: H1.3 H3.4 H4.4 Q1.2 R5.1
ATOMG21: H2.1 H3.6 H4.6 MPR121.2 R2.1
ATOMG22: H1.2 H3.7 H4.7 MPR121.1 R3.1
ATOMG23: H1.4 NOREF#50.1 NOREF#52.4
ATOMG25: H2.2 H3.5 H4.5 MPR121.3 R1.1
ATOMG33: H1.5
LED_LEFT_IN: LED1.4 Q1.3 R6.1
LED_LEFT_OUT: H7.1 H8.1 H9.1 H10.1 LED36.1 LED37.4
LED_RIGHT_OUT: LED72.1
TOUCH1: MPR121.8
TOUCH2: MPR121.9
TOUCH3: MPR121.10
TOUCH4: MPR121.11
TOUCH5: MPR121.12
TOUCH6: MPR121.13
TOUCH7: H7.2 H8.2 H9.2 H10.2 MPR121.14
TOUCH8: H7.3 H8.3 H9.3 H10.3 MPR121.15
TOUCH9: H7.4 H8.4 H9.4 H10.4 MPR121.16
TOUCH10: H7.5 H8.5 H9.5 H10.5 MPR121.17
TOUCH11: H7.6 H8.6 H9.6 H10.6 MPR121.18
TOUCH12: H7.7 H8.7 H9.7 H10.7 MPR121.19
$1N10297: MPR121.7 R4.1
$1N10451: C74.2 MPR121.5
$1N12824: H5.4 H6.4
$1N12826: H5.5 H6.5
$1N12828: H5.6 H6.6
$1N12830: H5.7 H6.7
$2N1042: LED44.1 LED45.4
$2N1048: LED52.1 LED53.4
$2N1058: LED60.1 LED61.4
$2N1227: LED68.1 LED69.4
$2N2509: LED37.1 LED38.4
$2N2525: LED38.1 LED39.4
$2N2541: LED39.1 LED40.4
$2N2557: LED40.1 LED41.4
$2N2573: LED41.1 LED42.4
$2N2589: LED42.1 LED43.4
$2N2605: LED43.1 LED44.4
$2N2635: LED45.1 LED46.4
$2N2651: LED46.1 LED47.4
$2N2667: LED47.1 LED48.4
$2N2683: LED48.1 LED49.4
$2N2699: LED49.1 LED50.4
$2N2715: LED50.1 LED51.4
$2N2731: LED51.1 LED52.4
$2N2761: LED53.1 LED54.4
$2N2777: LED54.1 LED55.4
$2N2793: LED55.1 LED56.4
$2N2809: LED56.1 LED57.4
$2N2825: LED57.1 LED58.4
$2N2841: LED58.1 LED59.4
$2N2857: LED59.1 LED60.4
$2N2887: LED61.1 LED62.4
$2N2903: LED62.1 LED63.4
$2N2919: LED63.1 LED64.4
$2N2935: LED64.1 LED65.4
$2N2951: LED65.1 LED66.4
$2N2967: LED66.1 LED67.4
$2N2983: LED67.1 LED68.4
$2N3013: LED69.1 LED70.4
$2N3029: LED70.1 LED71.4
$2N3048: LED71.1 LED72.4
$3N116: LED1.1 LED2.4
$3N132: LED2.1 LED3.4
$3N148: LED3.1 LED4.4
$3N164: LED4.1 LED5.4
$3N180: LED5.1 LED6.4
$3N196: LED6.1 LED7.4
$3N212: LED7.1 LED8.4
$3N242: LED9.1 LED10.4
$3N258: LED10.1 LED11.4
$3N274: LED11.1 LED12.4
$3N290: LED12.1 LED13.4
$3N306: LED13.1 LED14.4
$3N322: LED14.1 LED15.4
$3N338: LED15.1 LED16.4
$3N368: LED17.1 LED18.4
$3N384: LED18.1 LED19.4
$3N400: LED19.1 LED20.4
$3N416: LED20.1 LED21.4
$3N432: LED21.1 LED22.4
$3N448: LED22.1 LED23.4
$3N464: LED23.1 LED24.4
$3N494: LED25.1 LED26.4
$3N510: LED26.1 LED27.4
$3N526: LED27.1 LED28.4
$3N542: LED28.1 LED29.4
$3N558: LED29.1 LED30.4
$3N574: LED30.1 LED31.4
$3N590: LED31.1 LED32.4
$3N620: LED33.1 LED34.4
$3N636: LED34.1 LED35.4
$3N652: LED35.1 LED36.4
$3N720: LED8.1 LED9.4
$3N726: LED16.1 LED17.4
$3N740: LED24.1 LED25.4
$3N746: LED32.1 LED33.4

## Via types
v1: diameter 0.61, hole 0.305, Top Layer to Bottom Layer, 145 vias

## Routing (per net, layer and track width the routed paths; a pad name or vN(x,y) marks a point on that pad's centre or on a via; arc(x,y) is an arc through that point)
3V3: length 125.4
  Top Layer w0.254: Q1.1 48.13,125.48 48,125.34 R5.2 ; 28.87,120.03 28.87,119.67 29.28,119.26 31.5,119.26 32,119.76 33.78,119.76 ; R1.2 R2.2 R3.2 34.09,120.07 33.78,119.76 ; v1(46.1,125.35) 47.17,125.35 47.3,125.22 ; C73.2 v1(35.69,121.41) 34.92,120.65 34.92,120.02 34.67,119.76 33.78,119.76 ; H3.2 63.78,124.68 64,124.46 64.58,124.46 64.8,124.68 H4.2 72.55,124.68 73.02,124.21 H1.1 ; H6.2 97.17,124.68 96.95,124.46 96.38,124.46 96.15,124.68 H5.2
  Bottom Layer w0.254: H5.2 91.15,124.68 90.68,124.21 90.68,109.66 90.68,109.66 90.71,106.21 90.3,105.79 86.74,105.79 86.36,106.17 86.36,118.24 85.98,118.62 74.42,118.62 73.41,117.6 H1.1 ; H3.2 46.77,124.68 v1(46.1,125.35) 45.47,124.72 45.47,120.53 44.96,120.02 37.08,120.02 v1(35.69,121.41) 35.69,121.29
+5V: length 1379.1
  Top Layer w0.254: C1.1 14.04,147.16 13.28,147.04 12.35,147.71 12.28,148.17 12.53,148.52 ; 41.77,43.49 LED28.2 42.38,42.43 42.83,42.31 43.81,42.9 44,43.65 C28.1 ; 138.52,2.44 138.7,1.94 C63.1 ; 138.52,2.44 v1(138.09,2.29) ; 138.52,2.44 LED63.2 ; 134.39,41.75 134.66,41.71 LED57.2 ; C68.1 114.21,112.61 LED68.2 v1(115.71,112.3) ; C43.1 156.41,127.66 LED43.2 ; 148.92,109.91 148.81,110.63 148.44,110.56 147.26,110.4 147,110.43 ; 3.94,144.21 4.05,143.97 4.47,143.51 4.7,143.73 5.03,143.94 5.51,144.03 5.68,143.22 ; 3.94,144.21 3.95,144.22 ; 3.94,144.21 3.49,143.92 3,143.74 2.6,143.18 2.5,142.59 2.73,142.07 2.46,141.7 1.91,141.52 1.47,141 1.36,140.56 1.4,140.18 1.6,139.79 1.95,139.44 ; LED3.2 5.46,142.84 5.59,142.39 6.59,141.84 7.33,142.05 C3.1 ; 37.22,31.62 37.21,31.2 36.96,30.58 36.77,30.16 36.56,29.9 36.27,29.63 36.01,29.46 35.67,29.46 ; 32.79,28.23 32.85,28.23 ; 32.95,108.13 33.14,107.74 33.57,107.59 34.61,108.07 34.87,108.79 C33.1 ; 134.39,41.75 134.39,41.75 133.96,42.32 ; 144.89,104.65 145.9,104.78 145.94,104.78 146.07,104 ; 144.89,104.65 144.81,104.08 144.72,103.15 144.17,100.62 143.62,98.78 143.52,98.42 142.72,96.41 142.36,95.59 ; 144.89,104.65 144.89,104.65 144.91,104.78 145.01,105.59 145.02,105.85 145.1,106.06 145.55,106.93 145.91,107.55 146.17,108.24 146.85,109.99 147,110.44 ; 144.89,104.65 144.9,104.68 ; 147.02,118.77 147.23,118.16 147.41,117.24 147.64,115.86 147.63,114.63 147.58,113.58 149.1,113.75 150.57,114.09 151.42,114.24 152.21,114.41 152.63,114.53 153.02,114.71 153.35,114.88 153.6,115.09 153.48,115.45 153.86,115.59 ; 3.8,123.61 4.55,123.41 6.01,123.06 6.02,123.15 6.7,123.88 7.88,124.18 7.68,124.48 7.54,124.94 7.69,125.46 7.79,125.64 8.26,125.44 10.58,124.68 10.75,124.65 10.65,124.38 ; 5.04,115.92 5.25,115.5 6.33,115.13 7.02,115.46 C11.1 ; 150.95,146.65 149.91,145.86 ; 118.23,142.69 117.02,142.14 112.75,140.07 110.42,138.72 109.39,138.09 106.49,136.06 ; v1(132.77,83.1) 133.53,83.86 ; 32.4,27.64 32.13,28.01 ; LED4.2 5.25,136.81 5.41,136.38 6.45,135.89 7.17,136.16 C4.1 ; 131.16,31.05 130.57,30.91 130.72,30.42 ; LED62.2 122.28,36.06 ; 148.47,119.22 147.76,118.99 147.26,118.85 ; 148.47,119.22 148.73,118.3 ; 148.47,119.22 150.14,119.76 150.73,120.03 151.5,120.3 ; LED51.2 143.2,95.23 ; 32.91,27.29 32.53,27.45 32.39,27.64 ; LED17.2 15.52,66.19 15.82,65.83 16.95,65.71 17.55,66.19 17.89,66.16 17.97,66.92 ; 6.62,116.85 5.82,117.11 5.51,117.21 ; 33.37,27.23 32.91,27.3 ; 118.23,142.69 122.54,144.42 127.89,146.28 130.63,146.99 133.17,147.38 139.02,147.6 140.2,147.55 141.35,147.39 142.96,146.72 ; 153.35,130.62 152.15,130.09 C42.1 ; 147.2,145.19 148.06,145.54 148.48,145.76 148.97,145.97 arc(149.03,145.98) 149.07,146 149.43,146.15 149.88,145.59 ; 26.18,36.55 26.29,36.46 ; 26.29,36.46 26.2,36.54 25.74,37.45 25.71,37.62 25.84,38.11 25.37,38.18 24.99,38.4 24.42,39.12 ; 26.29,36.46 27.08,35.83 ; 2.23,129.39 2.87,129.17 2.59,128.24 ; 2.23,129.39 2.23,129.4 ; 2.23,129.39 2.14,129.43 1.33,129.92 0.84,130.43 0.69,130.88 0.73,131.4 1.24,131.97 1.72,132.12 ; 2.23,129.39 2.01,128.85 1.47,128.67 1.12,128.14 1.12,127.75 1.24,127.36 1.48,127.09 1.38,126.73 1.38,126.32 1.76,125.94 1.52,125.47 1.49,125.1 1.61,124.71 1.96,124.35 2.37,124.1 3.82,123.6 3.57,122.74 ; 14.36,147.01 14.65,147.39 14.98,147.19 15.82,146.86 16.51,146.72 16.93,146.76 17.64,147 18.42,147.35 19.73,147.85 20.89,148.05 21.92,148.05 28.07,147.83 30.65,147.44 33.44,146.7 38.76,144.87 44.06,142.69 48.64,140.41 49.99,139.62 52.03,138.37 54.92,136.35 55.72,135.74 57.73,134.12 59.05,132.99 60.2,131.94 60.92,131.26 61.47,130.69 61.47,129.77 v1(60.98,129.29) ; 8.44,108.11 8.16,108.18 6.8,108.72 6.18,109.35 6.1,109.69 6.21,110.11 6.51,110.55 6.88,110.74 7.05,111.22 ; 151.74,136.5 151.68,136.91 151.41,138.14 151.26,138.94 150.73,140.3 150.38,141.28 150.2,141.57 149.13,143.18 148.68,143.69 148.02,144.39 ; 131.26,29.04 130.92,30.31 130.72,30.42 ; 155.33,121.93 154.58,122.08 154.39,122.14 154.11,121.79 153.11,121.05 152.57,120.75 151.5,120.3 ; C44.1 147.85,123.17 147.96,123.4 LED44.2 ; 10.1,110.75 9.62,110.84 8.11,111.3 7.86,111.08 7.79,110.96 7.38,111.15 7.02,111.25 ; 37.22,31.62 36.66,31.57 36.12,31.65 35.88,31.8 35.96,32.95 ; v1(141.44,51.99) C55.1 141.33,51.39 LED55.2 ; 153.76,136.2 153.74,136.23 ; 153.74,136.23 153.83,136.46 LED40.2 ; 153.74,136.23 153.46,136.99 151.88,136.48 ; 150.41,129.86 150.41,129.85 ; 150.41,129.85 150.15,129.31 149.91,128.85 149.13,127.44 147.98,125.68 146.89,124.3 146.81,124.23 145.25,122.68 ; 150.41,129.85 150.4,129.86 150.71,130.6 151.3,132.51 151.48,133.5 151.62,134.51 151.67,135.85 151.72,136.5 ; 150.41,129.85 150.48,129.73 150.84,129.86 151.82,130.32 152.04,129.85 ; LED50.2 144.78,98.39 C50.1 ; v1(124.13,137.31) LED71.2 123.06,136.2 122.92,135.96 ; 9.5,105.12 9.4,104.76 9.27,104.72 9.03,104.52 8.85,104.15 8.88,103.62 9.33,103.2 10.19,102.85 10.44,102.77 10.66,102.71 10.56,102.22 10.5,102.21 10.31,101.89 10.3,101.58 10.43,101.3 11.05,100.91 11.18,100.62 11.4,100.19 11.31,100.03 11.37,99.58 11.94,99.16 12.37,98.86 12.58,99.16 13.19,99.42 14.16,99.18 ; v1(118.45,43.97) LED64.2 116.93,43.97 C64.1 ; 21.86,63.66 22.23,63.45 22.68,63.57 23.25,64.56 23.05,65.3 23.22,65.6 ; 125.84,35.36 125.87,34.98 126.03,34.25 126.13,33.54 126.09,33.48 126.22,33.25 126.34,32.94 126.59,32.36 126.93,32.01 127.32,31.82 127.79,31.76 128.11,31.8 128.36,31.84 128.48,31.51 128.6,30.65 128.11,30.65 ; 125.84,35.36 125.71,36.89 125.69,37.02 125.44,37.91 ; 125.84,35.36 124.72,35.24 124.92,35.07 LED61.2 ; LED32.2 45.24,110.97 45.53,110.66 45.99,110.65 46.83,111.43 46.86,112.2 C32.1 ; 145.2,122.54 146.31,120.62 146.73,119.43 146.99,118.8 ; LED26.2 39.35,33.77 39.66,34.11 39.6,35.25 39.02,35.77 C26.1 ; C65.1 125.07,56.25 LED65.2 v1(126.55,55.95) ; 23.04,3.89 22.64,4.04 22.22,3.84 21.83,2.77 22.16,2.07 C27.1 ; 23.04,3.89 23.29,4.58 ; 23.04,3.89 23.04,3.89 ; 6.09,131.77 7.1,131.29 ; C70.1 135.47,111.45 136.64,112.05 v1(136.29,112.78) ; v1(32.65,108.84) 32.96,108.13 ; C18.1 17.52,59.07 ; C18.1 17.68,58.32 ; C18.1 17.35,58.25 16.93,57.6 15.81,57.37 15.42,57.62 LED18.2 ; 35.97,33 35.96,32.95 ; 35.96,32.95 36.35,32.93 36.7,33.23 36.78,34.37 36.28,34.95 36.3,35.29 C25.1 ; 5.41,137.23 5.63,137.67 4.46,138.22 4.4,138.18 4.08,138.05 3.89,138.12 2.59,138.71 1.91,139.15 ; 156.24,127.47 156.24,127.73 156.08,127.88 155.78,127.78 155.77,127.79 155.13,127.59 155.01,127.56 154.74,127.58 154.7,127.34 154.56,127.08 154.44,126.91 153.31,126.15 152.74,125.86 150.43,125.12 147.53,124.39 ; R6.2 52.83,123.07 53.21,122.68 53.97,122.68 54.5,122.16 H3.3 ; 129.88,33.46 129.46,33.54 129.38,32.89 129.17,32.41 128.82,32.03 128.35,31.85 ; C24.1 33.02,30.28 33.55,29.72 33.53,28.58 33.2,28.26 32.79,28.27 ; 35.86,136.81 35.75,136.4 35.98,136 37.08,135.7 37.75,136.09 C35.1 ; 5.51,117.21 5.01,117.35 ; 5.51,117.21 5.14,116.13 5.21,116.2 ; v1(130.38,38.42) C58.1 130.91,37.68 LED58.2 ; 6.89,111.29 5.48,111.91 4.83,112.55 4.74,112.55 4.71,112.82 4.81,113.13 5.03,113.56 ; C37.1 146.68,147.24 LED37.2 ; 143.07,95.13 143.04,95.61 142.42,95.51 ; 10.2,147.91 9.54,148.06 9.12,148.17 8.33,148.09 7.99,147.88 7.74,147.49 7.69,147.12 7.82,146.79 7.28,146.88 6.7,147.03 6.24,147.01 5.91,146.86 5.68,146.55 5.59,146.06 5.23,145.76 4.52,145.6 4.03,145.04 3.89,144.3 3.94,144.21 ; 24.42,39.12 24.28,39.3 24.19,39.94 23.83,39.97 23.43,40.2 22.44,41.35 22.4,41.74 22.17,41.82 arc(22.12,41.83) 22.07,41.85 22.07,41.85 21.48,42.25 20.8,43.07 20.69,43.38 21.12,43.66 ; 24.42,39.12 LED21.2 25.48,39.78 25.94,39.86 26.61,40.78 26.49,41.54 C21.1 ; 3.08,120 3.25,120.13 2.92,120.39 2.7,120.27 ; 32.79,28.26 32.77,28.23 32.33,28.22 31.98,27.9 31.66,27.47 ; 122.11,37.35 124.24,37.62 125.26,37.86 125.44,37.91 ; LED2.2 9.48,146.79 9.55,146.33 10.46,145.65 11.23,145.75 11.5,145.55 ; 5,117.36 3.48,118.04 2.88,118.52 2.66,119.03 2.76,119.53 3.08,120 ; 10.08,119.19 9.23,119.44 8.73,117.78 ; 31.66,27.47 31.31,27.01 ; 31.66,27.47 31.32,27 ; 29.28,35.55 28.49,35.85 28.6,36.13 28.42,36.19 27.88,35.92 27.37,35.87 27.08,35.88 ; 60.96,129.29 60.45,129.29 59.82,128.65 59.82,125.15 59.81,125.15 59.81,123.96 59.82,123.96 59.82,122.98 H3.3 ; C10.1 11.95,118.39 11.27,118.03 10.17,118.36 9.96,118.77 LED10.2 ; 11.11,124.18 10.99,123.77 11.21,123.36 12.3,123.03 12.98,123.39 13.31,123.29 ; C12.1 12.02,109.9 11.39,109.45 10.27,109.65 10,110.03 10.07,110.45 ; 131.18,31.05 131.36,31.11 131.19,31.63 130.63,33.14 ; 157.09,133.93 156.44,133.57 ; 101.65,129.26 100.45,130.46 100.45,130.88 100.71,131.12 101.32,131.72 102.61,132.88 103.76,133.86 106.48,136.07 ; H2.3 89.53,109.98 90.04,110.49 90.04,121.67 90.53,122.16 H5.3 96.43,122.16 96.91,121.68 97.49,121.68 97.96,122.16 H6.3 ; C7.1 4.44,127.4 3.75,127.05 2.66,127.41 2.45,127.82 2.59,128.23 ; 143.62,98.7 143.85,98.68 144.51,98.82 144.61,98.18 ; C5.1 3.64,133.92 2.91,133.66 1.88,134.14 1.72,134.58 ; 130.72,30.42 130.68,30.45 ; 20.02,51.44 19.72,51.27 19.52,50.52 18.53,49.95 18.09,50.07 LED19.2 ; C31.1 52.48,89.26 52.6,90.02 53.53,90.69 53.98,90.62 54.24,90.27 ; 11.16,124.19 10.66,124.38 ; 8.71,117.79 8.05,118.05 7.83,117.7 7.05,117.42 6.63,116.86 ; 146.4,147.28 145.88,146.99 145.45,146.83 145.12,146.73 ; 122.11,37.35 122.13,36.23 ; 12.38,98.85 12.28,98.66 12.21,98.3 12.29,98.01 12.57,97.66 13.03,97.31 13.14,97.24 12.99,96.84 13.06,96.75 13.19,96.53 14.27,96.1 14.37,96.08 15.65,95.81 15.66,95.8 ; LED41.2 157.18,134.14 ; 147.53,124.38 146.81,124.22 ; 155.23,116.29 153.98,115.86 C47.1 ; 129.88,33.46 130.57,33.29 ; 9.26,105.18 8.13,105.63 7.6,106.13 7.62,106.21 7.53,106.55 7.6,106.94 7.83,107.37 7.87,107.39 8.23,107.65 8.45,108.11 ; 147.57,113.58 147.44,112.49 147.37,112.02 147.03,110.5 ; 45.24,110.98 44.73,111.55 ; 151.43,133.19 152.14,133.46 152.61,133.62 152.63,133.63 154.44,134.39 155,134.65 155.25,134.74 155.59,134.89 arc(155.62,134.9) 155.64,134.91 155.79,134.97 156.13,134.56 156.2,134.47 arc(156.25,134.42) 156.31,134.38 156.37,134.33 156.37,133.97 156.24,133.77 156.39,133.61 ; 130.68,37.81 131.54,38.2 130.48,40.01 ; C69.1 126.11,109.04 LED69.2 v1(127.61,109.21) ; 27.58,83.85 28.06,83.73 28.33,83.14 ; C9.1 5.44,121.92 4.75,121.56 3.66,121.89 3.44,122.3 LED9.2 ; 2.05,121.73 2.31,120.53 2.42,119.93 2.7,120.26 ; 12.47,148.69 12.09,148.94 11.76,148.92 11.49,149.15 11.09,149.04 10.74,148.66 10.63,148.41 10.62,148.09 10.55,147.84 10.29,147.91 9.78,147.18 ; 147.11,145.23 146.46,145.76 146.11,146.01 145.34,146.49 145.05,146.7 144.68,146.64 144.13,146.61 143.58,146.63 142.96,146.73 ; 2.04,136.02 1.88,135.6 2.21,135.47 1.96,135.01 ; H3.3 63.03,122.16 63.51,121.68 64.09,121.68 64.57,122.16 H4.3 ; C15.1 17.62,95.17 16.99,94.73 15.87,94.93 15.6,95.31 LED15.2 ; 33.86,55.39 34.38,54.8 ; 36.05,137.56 35.86,136.81 ; LED39.2 153.45,142.4 C39.1 ; C16.1 27.25,83.91 26.6,83.5 25.48,83.76 25.24,84.15 LED16.2 ; 28.43,30.46 28.18,31.28 28.17,32.35 28.3,33.61 27.71,33.85 27.3,34.38 27.08,35.11 27.01,35.82 ; 4.96,116.39 4.47,116.56 4.59,116.89 4.41,116.96 3.94,116.7 3.63,116.16 ; 23.5,112.43 23.86,113.12 ; 30.63,38.3 30.38,37.68 ; 30.38,37.68 C22.1 ; 30.38,37.68 30.26,37.36 30.56,36.65 30.13,35.59 29.7,35.41 LED22.2 ; 37.21,31.18 37.78,31.25 38.26,31.54 38.62,32.03 39.05,32.8 ; 23.02,45.16 22.77,44.93 22.75,44.15 21.91,43.38 21.45,43.39 LED20.2 ; 38.92,33.72 38.95,32.97 ; 3.71,115.29 3.98,115.05 3.9,114.77 4.14,114.16 4.3,113.98 4.37,113.95 4.38,113.93 4.82,113.77 5.02,113.56 ; 147.52,104.47 146.23,104.22 146.08,103.99 ; LED46.2 148.88,118.5 ; 153.36,142.14 153.16,142.61 152.67,142.39 152.42,142.3 151.31,141.97 150.18,141.67 ; 14.91,103.94 14.58,104.01 13.94,103.58 12.82,103.79 12.56,104.18 12.64,104.6 ; 2.06,121.73 1.87,122.23 1.85,122.35 1.88,122.81 2.14,123.24 2.56,123.49 2.73,123.87 2.76,123.88 ; 138.03,45.2 137.52,45.65 137.05,45.13 136.34,44.43 135.18,43.34 134.27,42.57 133.96,42.32 133.34,41.84 132.14,41.01 131.66,40.7 129.51,39.49 128.09,38.85 126.97,38.37 125.44,37.91 ; 122.13,36.23 C62.1 ; v1(143.06,66.99) C53.1 143.32,66.45 LED53.2 ; 9.61,105.1 9.82,105.04 9.91,105.35 10.13,105.27 12.09,104.85 12.03,104.72 12.64,104.61 ; C6.1 8.53,130.04 7.81,129.76 6.76,130.23 6.6,130.66 6.77,131.05 ; C66.1 137.99,65.73 LED66.2 v1(139.33,64.98) ; LED48.2 149.08,110.15 C48.1 ; C36.1 23.26,137.23 22.85,136.58 21.74,136.32 21.35,136.56 21.25,136.98 LED36.2 ; v1(107.11,89.21) LED67.2 108.63,89.07 C67.1 ; 3.62,116.13 3.55,115.74 3.71,115.29 ; LED56.2 138.31,45.21 138.03,45.2 ; 133.53,84.06 133.68,84.29 LED52.2 ; 19.63,52.1 20.02,51.44 ; C72.1 137.66,137.51 138.94,137.22 v1(139.1,138) ; 54.69,89.64 54.24,90.28 ; 124.68,35.23 124.71,35.24 ; 14.12,98.93 14.03,98.51 14.28,98.13 15.4,97.89 16.05,98.31 16.39,98.24 ; LED54.2 143.54,58.44 C54.1 v1(143.47,59.04) ; 28.42,30.46 28.88,29.92 28.73,28.58 29.06,27.36 29.5,26.93 30.1,26.67 30.42,26.66 30.93,26.74 31.29,26.99 ; 142.35,95.6 141.96,94.94 141.63,94.23 141.24,93.54 139.54,90.99 137.92,88.94 136.76,87.7 136.52,87.39 133.44,84.51 133.52,84.07 ; 1.87,135.61 1.15,135.5 0.64,134.95 0.5,134.33 0.62,133.77 0.51,133.56 0.51,133.06 1.42,132.26 1.61,132.26 1.97,132.05 3.34,131.38 3.35,131.38 4.67,130.87 4.84,130.87 4.86,130.89 4.92,130.9 5.34,131.46 5.46,131.54 6.09,131.77 ; 2.09,136.08 1.09,136.86 0.65,137.57 0.66,137.92 0.8,138.31 1.26,138.8 1.75,138.95 2.07,139.36 2,139.4 ; 29.54,28.7 28.82,28.89 ; LED34.2 23.3,112.04 23.44,111.6 24.46,111.08 25.2,111.32 C34.1 ; C29.1 35.99,56.02 35.97,55.25 35.13,54.47 34.67,54.48 34.37,54.8 ; 30.34,30.92 30.25,30.59 30.64,29.92 30.34,28.82 29.94,28.59 LED23.2 ; C60.1 128.3,30.45 LED60.2 ; 143.11,95.1 C51.1 ; 147.18,145.17 148.01,144.39 ; 21.2,64.06 21.88,63.65 ; 148.77,118.28 148.75,118.25 ; 36.33,35.96 36.3,35.29 ; 156.68,122.54 155.43,122.16 ; 147.85,123.17 147.51,124.34 ; C61.1 v1(124.67,35.93) ; 21.25,136.98 21.08,137.75
  Bottom Layer w0.254: v1(126.55,55.95) 126.92,55.95 126.98,56.01 127.37,56.01 127.76,55.62 ; 127.76,55.62 127.76,53.72 118.45,44.41 v1(118.45,43.97) ; 127.76,55.62 128.15,56.01 128.78,56.01 134.11,61.34 135.8,61.34 136.27,60.88 136.27,58.61 138.43,56.45 140.52,56.45 141.99,57.91 141.99,62.74 140.33,64.4 140.33,64.52 139.87,64.98 v1(139.33,64.98) 141.86,67.5 141.86,71.31 123.96,89.21 v1(107.11,89.21) 107.11,92.63 108.97,94.49 108.97,107.83 113.43,112.3 v1(115.71,112.3) 116.08,112.3 116.09,112.3 116.57,112.3 116.92,111.96 116.92,109.91 117.6,109.22 127.61,109.22 v1(127.61,109.21) 128,109.6 128.78,109.6 129.16,109.22 129.16,108.46 129.67,107.95 132.08,107.95 136.29,112.16 v1(136.29,112.78) 136.29,114.41 124.33,126.37 124.33,133.35 123.06,134.62 123.06,137.8 123.7,138.43 125.09,138.43 125.6,137.92 125.6,137.16 ; v1(124.13,137.31) 124.13,137.24 124.71,136.65 125.09,136.65 125.6,137.16 ; v1(23.29,4.58) 23.29,5.38 31.03,25.53 31.03,26.97 31.29,27.23 v1(33.38,27.23) 33.45,27.23 v1(35.65,29.44) ; v1(118.45,43.97) 118.77,43.97 118.92,44.12 119.58,44.12 119.76,43.94 119.76,43.78 119.76,43.78 119.76,43.3 119.76,43.3 119.76,41.91 123.19,38.48 127.13,38.48 128.4,39.75 130.68,39.75 132.33,38.1 135,38.1 136.98,40.08 136.98,45.73 140.72,49.47 140.72,51.26 v1(141.44,51.99) 143.47,54.02 143.47,56.19 143.51,56.23 143.51,56.71 143.47,56.75 v1(143.47,59.04) 143.47,63.46 143.93,63.92 143.93,66.13 v1(143.06,66.99) 143.06,71.83 132.9,81.99 132.9,82.98 v1(132.77,83.1) ; v1(118.45,43.97) 118.45,41.7 122.68,37.47 127.8,37.47 128.94,38.61 130.19,38.61 v1(130.38,38.42) ; v1(139.1,138) 139.1,137.2 138.56,136.65 126.11,136.65 125.6,137.16 ; H6.3 101.65,123.41 v1(101.65,129.29) ; v1(124.67,35.93) 124.67,33.32 130.45,27.54 130.45,25.49 138.54,4.41 138.54,2.73 v1(138.09,2.29) ; v1(28.34,83.08) 28.83,82.59 28.83,82.44 17.97,71.59 v1(17.97,66.92) 17.11,66.06 17.11,59.48 v1(17.52,59.07) 17.49,59.04 17.49,56.26 19.64,54.11 v1(19.64,52.1) 19.64,50.32 30.99,38.97 30.99,38.66 v1(30.63,38.3) ; v1(21.19,64.04) 20.57,64.65 20.57,65.15 20.95,65.53 22.61,65.53 ; 22.61,65.53 23.62,66.55 23.62,71.25 40.89,88.52 54.4,88.52 54.69,88.81 v1(54.69,89.64) 54.69,91.16 52.38,93.47 50.16,93.47 49.91,93.73 49.91,108.21 48.39,109.73 48.39,110.37 46.04,112.71 45.1,112.71 44.75,112.37 44.75,111.58 v1(44.73,111.55) 44.73,110.89 44.46,110.62 33.91,110.62 32.64,109.35 32.64,108.85 v1(32.65,108.84) 32.65,108.22 32.38,107.95 31.62,107.95 26.29,113.29 25.02,113.29 24.89,113.41 24.26,113.41 23.97,113.12 v1(23.86,113.12) 23.75,113.23 23.75,132.72 23.24,133.23 22.48,133.23 21.08,134.63 v1(21.08,137.74) 21.15,137.81 21.15,137.98 21.68,138.51 22.29,138.51 22.63,138.17 22.63,137.69 22.47,137.53 22.47,136.53 23.77,135.24 34.47,135.24 34.67,135.44 34.67,137.31 34.92,137.56 v1(36.04,137.56) 36.28,137.33 36.28,136.82 42.92,130.18 60.1,130.18 v1(60.98,129.29) ; 22.61,65.53 22.86,65.28 26.54,65.28 33.27,58.55 33.27,55.97 v1(33.85,55.39) 33.87,55.4 33.87,56.22 34.17,56.52 37.08,56.52 39.88,53.72 39.88,44.33 40.72,43.48 v1(41.77,43.48) 41.9,43.62 41.9,44.16 42.25,44.51 44.32,44.51 45.21,43.62 45.21,39.5 44.7,38.99 38.23,38.99 36.27,37.03 36.27,36.02 v1(36.34,35.95) ; H2.3 89.28,109.98 89.66,110.37 89.66,121.67 89.17,122.16 H4.3
GND: length 1405.7
  Top Layer w0.254: 147.32,96.9 147.2,97.42 ; C41.2 157.86,133.03 158.12,133.76 159.16,134.24 159.59,134.08 159.77,133.69 ; LED57.3 135.2,38.42 135.21,38.2 135.63,38.3 136.09,38.57 136.7,39.31 136.79,40.02 137.38,40.11 137.87,40.37 138.51,41.16 138.61,41.94 138.53,42.06 138.86,42.11 139.2,42.27 138.88,42.64 138.87,42.66 ; LED57.3 134.7,39.11 ; LED57.3 135.07,39.33 135.14,39.79 134.47,40.71 133.71,40.84 C57.2 ; 12.93,122.17 12.93,122.17 ; 12.93,122.17 12.68,122.05 LED8.3 ; 12.93,122.17 12.55,121.12 ; 152.12,123.28 152.12,123.28 ; 152.12,123.28 152.11,123.27 ; 152.12,123.27 152.11,123.27 ; 152.12,123.28 152.18,123.32 152.12,123.28 ; 152.12,123.28 152.91,123.86 ; 157.37,120.28 154.93,119.56 154.62,119.44 154.47,119.42 154.39,119.13 154.03,118.71 153.61,118.35 153,118 152.37,117.71 152.18,117.64 151.58,117.48 ; 159.94,133.21 159.79,132.98 159.67,132.76 159.63,132.6 159.56,132.44 ; LED29.3 36.98,55.18 36.99,55.46 ; 123.81,31.15 123.34,31.17 122.77,31.47 122.28,32.02 121.89,32.79 121.71,32.77 121.07,32.97 120.61,33.3 120.5,33.57 120.69,34 ; 156.74,143.53 156.7,143.17 156.73,142.68 156.6,142.32 156.07,142.15 ; LED43.3 158.79,127.31 158.38,127.53 157.29,127.17 156.94,126.49 C43.2 ; 38.05,37.27 38.21,35.63 38.23,35.13 37.41,35.2 37.57,35.01 37.48,33.7 ; 157.5,120.2 157.9,120.05 158.28,119.5 158.36,119 158.11,118.48 157.54,117.98 156.41,117.45 156.58,116.93 156.65,116.97 157.17,116.71 157.47,116.19 157.54,115.75 157.42,115.35 156.89,114.77 156.63,114.69 ; v1(29.6,124.05) 29.6,123.99 28.87,123.26 28.87,122.8 ; C44.2 148.54,122.24 148.86,122.94 149.94,123.33 150.36,123.13 LED44.3 ; 20.56,50.51 20.95,49.83 ; 35.49,37.87 36.83,37.51 37.92,37.31 ; 42.91,142.63 44.12,142.08 48.39,140.01 50.72,138.67 51.75,138.03 54.65,136.01 ; LED10.3 11.71,117.12 11.94,117.24 ; 3.44,132.77 3.49,132.79 ; 123.56,32.82 122.99,32.77 123.14,32.21 123.65,31.69 123.82,31.6 123.81,31.16 ; 126.12,28.27 125.95,29.35 125.14,29.37 124.56,29.67 124.15,30.26 123.81,31.15 ; 149.05,147.65 148.6,147.72 147.67,147.05 147.55,146.29 147.27,146.08 ; 145.34,56.52 145.43,56.94 145.18,57.33 144.06,57.57 143.42,57.15 143.08,57.22 v1(142.92,56.47) ; 158.99,132.1 156.33,130.92 156.16,130.58 156,130.16 155.53,129.66 154.9,129.16 154.75,129.61 ; C60.2 127.02,30.28 127.57,29.74 127.59,28.6 127.27,28.27 LED60.3 ; 158.36,142.12 158.57,142.67 158.45,143.24 158.05,143.76 157.48,143.92 157.18,144.17 ; LED59.3 130.45,27.94 130.68,28.34 130.38,29.45 129.71,29.83 129.63,30.17 ; LED51.3 145.51,94.55 145.13,94.82 144.01,94.62 143.56,93.99 C51.2 ; 4.43,126.27 5.24,126.01 5.72,127.61 ; 17.78,65.07 17.7,64.31 17.78,64.39 ; 123.2,134.9 123.54,134.99 123.92,135.66 125.03,135.96 125.43,135.73 LED71.3 v1(125.73,134.54) ; v1(114.24,109.44) LED68.3 115.06,110.35 115.04,110.81 114.21,111.59 113.44,111.57 C68.2 ; C23.2 31.54,30.4 LED23.3 ; 157.21,144.3 157.04,145.04 156.55,145.63 155.95,145.76 155.87,145.72 155.46,145.9 155.53,146.05 155.42,146.53 155,146.93 154.48,147.11 153.32,146.86 ; 7.03,140.83 6.91,140.41 7.39,140.16 8.38,139.77 9.55,139.41 9.84,139.19 10.81,141.43 11.94,143.16 12.37,143.65 ; 23.6,63.65 23.59,63.65 ; 23.6,63.65 24.28,63.25 ; 23.6,63.65 24.25,64.77 C30.2 ; 23.77,44.36 23.76,44.08 22.8,43.19 ; 13.34,116.11 11.75,116.48 11.95,117.25 ; LED12.3 11.94,108.6 C12.2 ; v1(129.38,38.01) C58.2 129.77,37.06 130.48,36.76 130.91,35.7 130.73,35.27 LED58.3 ; 14.26,145.52 14.73,145.92 15.21,146.23 15.46,146.4 15.68,146.33 16.5,146.19 17.07,146.24 17.8,146.49 18.18,146.67 ; LED5.3 3.23,132.69 ; C67.2 109.27,90.2 108.51,90.08 107.58,90.75 107.51,91.21 LED67.3 v1(108.21,92.2) ; LED17.3 17.56,64.9 ; 152.09,123.26 152.11,123.27 ; 152.09,123.26 150.97,122.6 150.54,122.79 ; 152.09,123.26 152.08,123.25 152.11,123.27 ; C45.2 155.94,120.97 156.3,121.65 157.4,121.98 157.81,121.76 LED45.3 ; 6.96,134.94 6.97,134.92 6.77,134.51 9.44,133.41 ; LED1.3 13.4,146.04 C1.2 ; 148.64,103.16 148.56,103.58 148.18,103.84 147.05,103.62 146.62,102.98 C49.2 ; 20.63,3.05 21.08,2.89 ; 21.08,2.89 21.34,3.59 21.34,3.6 ; 21.08,2.89 20.9,2.37 21.01,2.12 ; v1(139.15,5.14) 139.37,4.49 138.97,4.34 138.77,3.92 139.16,2.85 139.86,2.52 139.98,2.2 ; 12.36,143.66 13.05,144.44 13.87,145.22 14.26,145.52 13.79,145.91 ; 31.63,37.92 31.4,37.27 ; 3.47,132.72 4.08,132.43 4.6,133.53 4.72,133.8 4.69,134.34 4.69,134.34 4.75,134.35 5.06,134.71 6.53,134.01 8.38,133.27 9.21,132.97 ; 35.49,37.86 33.1,38.62 30.27,39.95 28.52,41.01 28.51,41 ; 5.5,114.63 6.74,114.2 C11.2 ; 10.9,144.65 10.64,144.22 12.34,143.68 ; C66.2 136.95,64.96 137.7,64.76 138.27,63.77 138.15,63.32 LED66.3 v1(137.09,62.73) ; 159.03,126.77 159.52,127.02 159.82,127.32 160.01,127.71 159.98,128.2 159.64,128.73 159.14,128.9 158.93,129.42 159.71,129.93 160.18,130.4 160.36,130.9 160.29,131.41 159.81,131.98 159.14,132.16 ; C38.2 150.8,144.92 150.91,145.69 151.82,146.38 152.28,146.31 152.54,145.97 ; 23.57,110.7 23.23,110.01 ; 159.19,132.21 159.44,132.35 arc(159.48,132.38) 159.51,132.4 ; C73.1 v1(38.99,121.41) ; C36.2 23.69,136.01 LED36.3 ; 10.84,144.67 10.57,144.64 9.52,145.43 ; 135.18,38.18 135.28,37.67 135.2,37.2 134.96,36.72 134.95,36.72 arc(134.93,36.69) 134.91,36.67 134.53,36.27 134.48,36.24 arc(134.44,36.22) 134.41,36.21 133.99,36 133.93,35.59 133.89,35.09 133.68,34.44 133.3,33.95 132.7,33.67 132.75,33.16 132.86,32.37 132.83,31.33 132.55,30.45 132.17,30.02 132.39,28.87 132.43,28.39 132.25,27.94 132.06,27.38 131.63,26.96 131,26.69 130.57,26.67 130.24,26.77 130.24,26.78 130.04,27.82 ; 12.17,108.76 12.04,107.98 15.04,107.42 13.88,110.38 13.31,113.45 12.57,113.62 11.7,113.73 8.9,114.35 8.38,114.47 ; 159.76,133.68 159.92,133.24 ; v1(98.65,129.29) 98.66,130.37 100.6,132.3 101.73,133.34 105.42,136.38 105.91,136.74 108.91,138.86 ; 5.73,127.61 6.04,127.72 6.18,128.02 6.39,128.36 6.47,128.47 6.62,128.62 7.02,128.62 8.04,128.16 ; C40.2 154.5,135.36 154.77,136.08 155.8,136.57 156.24,136.41 156.41,136.04 ; 38.06,37.29 40.01,37.04 ; 156.74,143.54 157.06,143.94 157.16,144.18 ; 51.56,89.94 51.61,90.21 52.67,90.99 ; C28.2 44.78,42.62 LED28.3 ; 40.09,36.18 40.09,37.05 ; 157.94,121.35 158.13,120.91 ; C46.2 149.4,117.31 149.76,117.99 150.85,118.32 151.26,118.1 LED46.3 ; v1(59.49,129.28) 60.24,130.03 60.6,130.03 60.69,130.12 60.69,130.82 60.42,131.07 59.82,131.67 58.53,132.83 57.38,133.81 54.65,136.01 ; 130.24,26.78 129.79,27.06 129.18,27.99 129.13,27.97 128.69,27.33 127.72,27.01 127.02,27.12 126.52,27.53 126.14,28.28 126.84,28.27 ; 156.67,114.45 156.43,114.32 156.24,114.21 156.18,114.14 156.15,113.82 ; 32.83,31.86 32.3,31.51 32.12,30.53 31.43,30.67 ; 52.22,91.6 52.68,90.99 ; 16.47,56.75 17.76,57.02 ; 31.52,37.24 32.55,36.79 32.34,36.35 31.91,35.01 31.82,34.71 ; 108.93,138.87 112.04,140.74 117,143.25 122.14,145.35 127.55,147.2 130.39,147.94 133.17,148.38 136.87,148.55 ; 9.44,133.41 9.44,132.94 ; 9.44,133.41 9.46,133.4 9.28,136.48 9.81,139.12 9.8,139.14 ; C47.2 154.54,114.69 154.88,115.38 155.96,115.76 156.38,115.55 LED47.3 ; 99.78,127.2 96.72,127.2 96.68,127.24 96.11,127.24 96.07,127.2 93.05,127.2 ; 125.39,107.95 125.7,107.81 126.42,108.07 127.46,107.59 127.62,107.15 LED69.3 v1(127.11,106.04) ; LED21.3 27.62,40.9 ; 28.51,41 28.31,40.68 27.59,41.17 ; 28.51,41 28.36,41.25 27.43,41.97 26.7,42.5 arc(26.67,42.51) 26.64,42.53 25.9,43.14 24.15,44.75 23.77,44.36 ; 24.36,87.38 26.44,85.49 27.26,84.87 28.47,84.59 28.63,84.29 28.54,83.77 30.37,82.38 30.36,82.27 27.95,82.36 27.34,82.83 ; v1(140.13,49.71) C55.2 140.81,50.2 141.56,50.4 142.55,49.83 142.67,49.38 LED55.3 ; 156.55,135.66 156.42,136.04 ; 14.71,102.87 14.47,102.72 LED13.3 ; 14.71,102.87 14.71,102.89 ; 14.71,102.87 14.55,102.09 14.85,102.03 15.7,101.81 16.48,101.66 ; R4.2 v1(38.99,124.46) ; 6.6,122.17 6.45,121.95 6.03,120.54 5.43,120.77 5.2,120.65 LED9.3 ; 12.06,126.76 11.11,127.07 9.23,127.71 8.05,128.17 8.39,128.9 8.14,128.8 6.94,129.34 ; 148.9,149.32 148.29,149.41 146.87,149.01 146.8,149.04 146.6,149.4 146.26,149.62 145.51,149.72 144.19,149.66 141.62,148.85 141.73,148.26 140.6,148.48 139.5,148.63 138.07,148.63 136.9,148.55 ; 13.36,116.09 13.64,118.01 13.85,118.65 14.52,120.48 14.56,120.62 ; LED24.3 34.31,30.4 C24.2 ; v1(117.61,40.9) LED64.3 118.23,41.94 118.12,42.39 117.14,42.98 116.39,42.79 C64.2 ; 147.33,96.91 148.06,97.27 148.51,97.6 148.76,97.88 148.88,98.23 148.83,98.55 148.66,98.75 149.13,99.09 149.67,99.54 149.73,99.87 149.66,100.14 149.9,100.4 150.09,100.63 150.25,100.89 150.72,101.25 150.84,101.54 150.8,101.87 150.64,102.14 150.56,102.15 150.33,102.7 150.88,102.8 151.65,103.12 152.22,103.64 152.2,104.2 151.99,104.57 151.72,104.72 151.57,105.14 ; 20.02,92.84 21.42,90.83 23.07,88.81 24.35,87.37 ; 31.81,34.71 31.7,34.15 31.69,33.21 31.82,32.66 32.14,32.24 32.65,31.95 32.93,31.87 33.47,31.86 34,32.01 34.33,32.35 34.68,32.96 ; 35.47,37.83 35.41,37.61 35.38,36.88 35.24,34.87 34.96,33.66 34.91,33.62 34.67,32.96 ; 153.09,123.96 153.44,123.91 153.94,123.79 154.42,123.6 ; C15.2 17.54,93.88 16.25,94.11 ; 157.85,123.62 158.16,123.77 ; 153.81,111.01 153.9,110.7 154.21,110.77 154.6,110.57 154.86,110.15 154.99,109.78 154.91,109.39 154.23,108.73 152.91,108.2 152.74,108.15 152.91,107.68 152.94,107.56 153.25,107.39 153.49,106.91 153.56,106.56 153.48,106.26 152.95,105.72 151.76,105.23 151.22,105.06 151.21,104.77 151.07,104.3 150.7,103.86 149.84,103.35 149.28,103.08 148.88,102.99 ; 157.36,123.8 157.84,123.61 ; LED3.3 6.83,140.85 ; LED50.3 147.12,97.79 146.73,98.04 145.61,97.81 145.19,97.16 C50.2 ; v1(143.34,64.39) C53.2 143.6,65.18 144.08,65.78 145.22,65.9 145.58,65.61 LED53.3 ; LED52.3 136.02,83.69 135.63,83.95 134.51,83.71 134.09,83.06 133.76,82.99 133.29,82.52 131.48,82.52 v1(131.42,82.58) ; 12.05,126.78 10.96,128.89 10.51,129.71 10.2,130.49 9.56,132.38 9.46,132.94 ; 158.37,142.12 158.66,141.65 159.15,141.54 159.63,141.01 159.76,140.69 159.71,140.35 159.53,139.84 159.01,139.39 159.27,138.9 159.34,138.94 159.83,138.77 160.29,138.33 160.37,137.97 160.38,137.59 160.01,136.92 159.1,136.19 159.49,135.77 159.64,135.58 159.97,135.5 160.45,134.97 160.58,134.44 160.43,133.82 160.26,133.6 159.98,133.25 ; 9.19,122.5 11.51,121.42 12.52,121.05 ; LED48.3 151.39,109.47 151.01,109.74 149.89,109.54 149.44,108.91 C48.2 ; 153.31,146.85 153.35,147.15 153.32,147.49 153.13,147.86 152.75,148.07 151.95,148.16 151.5,148.06 150.93,147.98 150.86,148.04 150.41,148.08 150.03,147.89 150.02,147.88 149.98,148.21 149.69,148.61 149.32,148.87 148.91,148.89 148.92,149.27 ; 153.31,146.85 153.3,146.76 ; 153.31,146.85 153.26,146.55 ; LED19.3 20.49,50.22 20.56,50.47 ; 6.6,122.17 6.55,122.42 6.68,122.76 7.09,123.24 7.75,123.41 7.91,123.41 9.19,122.5 ; 157.51,120.22 157.75,120.36 157.83,120.55 157.87,120.75 158.13,120.9 158.14,120.88 158.55,121.13 158.71,121.38 158.97,121.65 159.19,122.09 159.23,122.28 159.18,122.76 158.96,123.21 158.53,123.51 158.33,123.58 ; MPR121.4 30.12,121.81 30.48,122.18 v1(30.76,122.18) ; 2.93,126.54 4.18,126.13 C7.2 ; 154.88,123.1 156.7,123.63 arc(156.73,123.64) 156.76,123.64 157.31,123.8 ; 158.33,123.58 158.16,123.77 158.42,123.89 ; 158.95,126.9 159.13,126.44 159.08,126.19 159.4,125.93 159.64,125.51 159.64,125.14 159.48,124.72 158.41,123.9 ; 149.29,147.28 150.01,147.88 ; C16.2 27.1,82.62 25.82,82.92 ; 147.32,96.9 147.42,96.62 146.82,96.35 146.57,96.23 146.38,96.13 146.28,96.04 146.56,95.45 146.6,95.06 146.5,94.69 145.74,94.03 ; 42.91,142.63 38.6,144.36 33.25,146.22 30.51,146.94 27.97,147.33 22.12,147.54 20.94,147.5 19.78,147.34 18.18,146.67 ; 36.01,54.28 36.54,53.7 ; 22.41,135.71 22.59,134.96 ; 159.05,139.16 158.76,138.93 158.42,138.73 157.75,138.41 157.31,138.17 157.06,138.01 157.31,137.69 157.45,137.17 157.45,136.71 157.24,136.25 156.99,135.99 156.55,135.65 ; 5.57,135.48 6.76,134.93 ; 8.38,114.47 6.99,114.33 ; 13.35,116.05 13.32,113.61 ; NOREF#56.2 79.75,148.98 80.26,148.47 80.26,135.51 80.01,135.26 74.93,135.26 74.42,134.75 74.42,127.64 73.98,127.2 64.88,127.2 64.84,127.23 64.27,127.23 64.23,127.2 61.25,127.2 ; 137.18,136.3 137.52,136.22 138.17,136.63 139.28,136.38 139.53,135.98 LED72.3 v1(139.27,134.79) ; 153.8,111 153.75,111.17 154.17,111.26 155.62,111.85 156.3,112.54 156.31,113.17 156.08,113.48 155.91,113.63 156.14,113.82 ; v1(136.4,42.67) 137.29,43.56 C56.2 137.54,44.16 138.31,44.19 139.14,43.41 139.16,42.95 138.88,42.65 ; LED39.3 155.86,142.51 155.41,142.64 154.41,142.08 154.2,141.34 153.9,141.17 ; 34.36,107.13 34.68,106.44 ; 33.56,31.85 34.15,31.47 34.13,30.61 ; 16.5,101.61 17.29,98.67 arc(17.33,98.56) 17.38,98.47 18.06,96.74 18.56,95.65 19.99,92.9 18.94,92.98 17.64,93.18 17.78,94.04 ; 16.44,101.83 15.89,105.97 15.05,107.41 ; 18.07,56.51 17.91,57.26 ; 156.49,115.15 156.59,114.69 ; 36.11,134.4 36.29,135.14 37.56,134.81 C35.2 ; 154.42,123.6 154.76,123.18 ; 6.94,134.99 7.02,135.02 ; 11.95,117.26 11.95,117.25 ; C42.2 152.81,128.97 153.09,129.69 154.13,130.16 154.56,129.99 LED42.3 ; C26.2 40.3,35.98 40.37,34.73 40.36,34.73 ; 120.69,33.98 121.1,33.96 121.44,34.27 121.5,35.41 120.99,35.98 C62.2 ; 12.52,121.04 14.41,120.37 ; 151.73,108.78 152.02,108.87 152.38,109 152.85,109.29 153.23,109.59 153.51,109.99 153.62,110.39 153.57,110.87 153.8,110.98 ; 14.64,97.29 15.92,97.02 C14.2 16.86,97.03 17.21,98.87 ; 14.61,120.67 15.61,122.59 14.27,123.82 12.84,125.55 12.06,126.78 ; 43.65,41.94 44.08,41.26 ; v1(47.39,109.89) LED32.3 47.84,111.36 C32.2 ; v1(123.59,35.84) C61.2 123.64,34.83 124.23,34.33 124.31,33.19 124,32.84 LED61.3 ; v1(125.11,53.08) LED65.3 125.92,53.99 125.9,54.45 125.07,55.23 124.3,55.2 124.05,55.44 ; LED22.3 31.51,37.02 ; LED33.3 35.55,107.69 C33.2 ; v1(138.42,110.38) LED70.3 137.88,111.48 137.44,111.62 136.42,111.11 136.18,110.37 135.88,110.22 ; 37.42,35.88 37.39,35.22 ; C34.2 24.74,110.11 23.57,110.7 ; 152.54,145.98 153.24,146.52 ; C74.1 v1(38.99,122.94)
  Bottom Layer w0.254: v1(44.08,41.26) 44.08,40.27 43.81,40.01 40.13,40.01 ; v1(129.38,38.01) 129.19,38.01 128.14,36.96 123.95,36.96 ; v1(38.99,121.41) 36.83,121.41 36.07,122.18 v1(30.76,122.18) 30.58,122.35 30.52,122.35 29.6,123.28 v1(29.6,124.05) ; v1(38.99,121.41) v1(38.99,122.94) v1(38.99,124.46) 42.04,124.46 42.67,125.1 42.67,129.67 ; v1(38.99,121.41) 38.99,121.38 ; v1(137.09,62.73) 136.72,62.36 133.6,62.36 128.27,57.03 126.11,57.03 125.48,56.39 125.48,55.47 123.9,53.9 123.9,53.4 124.22,53.08 124.23,53.08 124.24,53.07 124.73,53.07 124.73,53.08 v1(125.11,53.08) 125.11,52.59 115.95,43.44 115.95,41.28 116.71,40.52 117.23,40.52 v1(117.61,40.9) 118.49,40.9 122.43,36.96 123.22,36.96 123.59,36.59 ; 40.13,40.01 33.73,40.01 v1(31.63,37.91) ; 40.13,40.01 38.86,41.28 38.86,53.22 37.72,54.36 37.2,54.36 v1(36.54,53.7) 36.52,53.69 36.52,52.89 36.18,52.55 35.08,52.55 32.26,55.37 32.26,58.04 26.03,64.26 25.28,64.26 v1(24.28,63.26) 24.76,62.77 24.76,58.93 22.61,56.77 20.32,56.77 19.05,58.04 19.05,65.15 20.45,66.55 22.1,66.55 22.61,67.06 22.61,71.76 40.39,89.54 51.94,89.54 52.34,89.93 52.34,91.49 v1(52.21,91.61) 52.21,92.06 51.82,92.46 49.66,92.46 48.89,93.22 48.89,107.83 47.73,108.99 47.39,108.99 ; v1(30.31,82.33) 29.49,82.33 18.56,71.39 18.56,66.57 17.7,65.71 v1(17.7,64.31) 17.7,59.77 18.1,59.37 18.1,56.54 v1(18.07,56.51) 20.22,54.36 20.22,50.56 v1(20.94,49.84) 20.94,49.8 31.62,39.12 31.62,37.91 v1(31.63,37.91) ; 123.59,36.59 v1(123.59,35.84) ; 123.59,36.59 123.95,36.96 ; 125.73,134.54 125.73,133.73 125.35,133.35 125.35,126.88 138.18,114.05 138.18,110.87 138.42,110.63 v1(138.42,110.38) 138.42,109.91 137.91,109.4 134.97,109.4 132.51,106.94 127.63,106.94 127.11,106.41 v1(127.11,106.04) 127.11,105.99 126.93,105.82 125.96,105.82 125.71,106.07 125.71,107.85 125.35,108.21 115.48,108.21 v1(114.24,109.44) 112.1,109.44 109.98,107.32 109.98,93.97 108.67,92.66 ; v1(31.63,37.91) 29.4,35.68 29.4,25.53 21.84,5.84 21.21,5.21 21.21,3.61 v1(20.63,3.03) ; 61.25,127.2 61.25,127.51 v1(59.49,129.28) 59.1,129.67 42.67,129.67 ; 47.39,108.99 47.12,108.72 46.52,108.72 45.64,109.6 34.92,109.6 34.67,109.35 34.67,106.45 v1(34.68,106.44) 34.68,105.92 34.26,105.5 33.67,105.5 33.33,105.84 33.33,106.63 33.02,106.94 31.37,106.94 26.03,112.27 25.02,112.27 24.82,112.07 24.05,112.07 23.88,111.89 23.88,110.66 v1(23.23,110.01) ; 47.39,108.99 v1(47.39,109.88) ; NOREF#56.2 78.52,149.75 82.46,149.75 NOREF#9.3 ; v1(108.21,92.2) 108.67,92.66 ; 108.67,92.66 108.91,92.66 109.55,92.02 109.55,90.11 109.86,89.79 124.21,89.79 v1(131.42,82.58) 142.48,71.52 142.48,66.75 143.34,65.89 v1(143.34,64.39) 143.34,64.07 142.89,63.62 142.89,56.51 v1(142.92,56.47) 142.92,54.3 140.13,51.51 v1(140.13,49.71) 136.4,45.97 v1(136.4,42.67) ; 67.98,127.2 89.72,127.2 90.17,126.75 90.62,127.2 93.05,127.2 ; 42.67,129.67 37.95,134.4 v1(36.11,134.4) 36.11,134.16 35.81,133.86 35.05,133.86 34.67,134.24 23.31,134.24 v1(22.59,134.96) ; 99.78,127.2 98.65,128.33 v1(98.65,129.29) 102.84,133.48 122.05,133.48 122.55,133.99 122.55,138.05 123.44,138.94 125.35,138.94 126.11,138.18 126.11,137.42 126.36,137.16 137.72,137.16 138.52,137.96 138.52,138.24 138.86,138.58 139.98,138.58 140.51,138.04 140.51,138 140.59,137.92 140.59,136.11 v1(139.27,134.79) 139.27,135.44 139.06,135.65 139.05,135.64 126.33,135.64 125.73,135.04 v1(125.73,134.54) ; 129.38,38.01 130.99,36.4 130.99,25.5 138.72,5.36 138.94,5.14 v1(139.15,5.14)
  Bottom Layer w0.502: 90.17,126.75 90.17,107.7 89.74,107.27 88.44,107.27 H2.4
  vias: v1(37.43,35.88)
